# EAGLE design IQModulator (EAGLE 7.6.0)

## Sheet 1 of 3
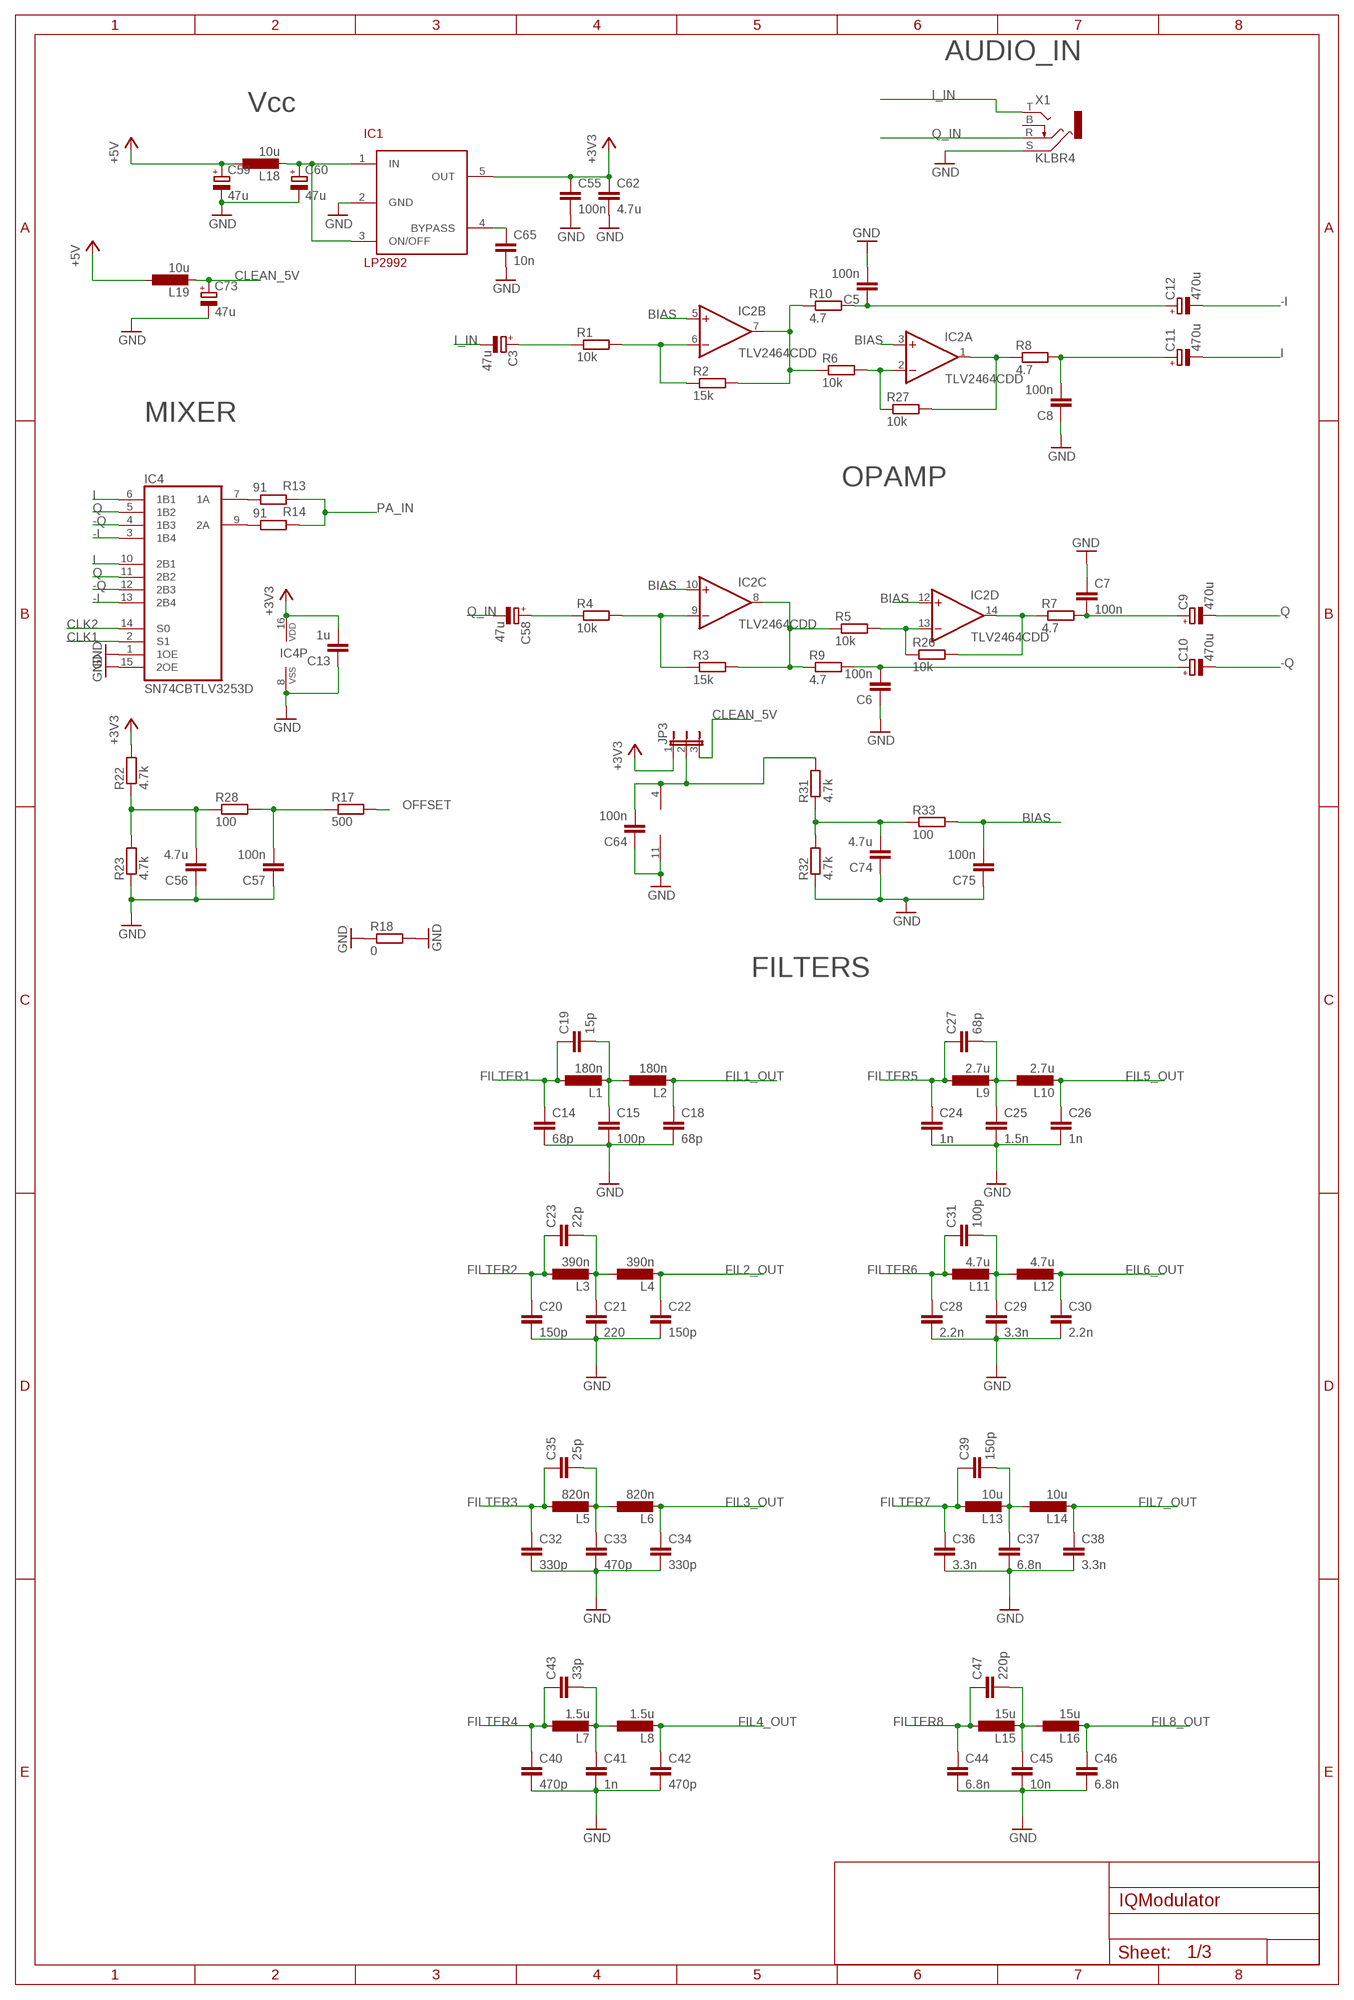
[diagram p0: schematic, sheet 1]

### Parts
C3  47u  CPOL-EUC  [PANASONIC_C]
C5  100n  C-EUC0805  [C0805]
C6  100n  C-EUC0805  [C0805]
C7  100n  C-EUC0805  [C0805]
C8  100n  C-EUC0805  [C0805]
C9  470u  CPOL-EUD  [PANASONIC_D]
C10  470u  CPOL-EUD  [PANASONIC_D]
C11  470u  CPOL-EUD  [PANASONIC_D]
C12  470u  CPOL-EUD  [PANASONIC_D]
C13  1u  C-EUC0805  [C0805]
C14  68p  C-EUC0805  [C0805]
C15  100p  C-EUC0805  [C0805]
C18  68p  C-EUC0805  [C0805]
C19  15p  C-EUC0805  [C0805]
C20  150p  C-EUC0805  [C0805]
C21  220  C-EUC0805  [C0805]
C22  150p  C-EUC0805  [C0805]
C23  22p  C-EUC0805  [C0805]
C24  1n  C-EUC0805  [C0805]
C25  1.5n  C-EUC0805  [C0805]
C26  1n  C-EUC0805  [C0805]
C27  68p  C-EUC0805  [C0805]
C28  2.2n  C-EUC0805  [C0805]
C29  3.3n  C-EUC0805  [C0805]
C30  2.2n  C-EUC0805  [C0805]
C31  100p  C-EUC0805  [C0805]
C32  330p  C-EUC0805  [C0805]
C33  470p  C-EUC0805  [C0805]
C34  330p  C-EUC0805  [C0805]
C35  25p  C-EUC0805  [C0805]
C36  3.3n  C-EUC0805  [C0805]
C37  6.8n  C-EUC0805  [C0805]
C38  3.3n  C-EUC0805  [C0805]
C39  150p  C-EUC0805  [C0805]
C40  470p  C-EUC0805  [C0805]
C41  1n  C-EUC0805  [C0805]
C42  470p  C-EUC0805  [C0805]
C43  33p  C-EUC0805  [C0805]
C44  6.8n  C-EUC0805  [C0805]
C45  10n  C-EUC0805  [C0805]
C46  6.8n  C-EUC0805  [C0805]
C47  220p  C-EUC0805  [C0805]
C55  100n  C-EUC0805  [C0805]
C56  4.7u  C-EUC0805  [C0805]
C57  100n  C-EUC0805  [C0805]
C58  47u  CPOL-EUC  [PANASONIC_C]
C59  47u  CPOL-EUC  [PANASONIC_C]
C60  47u  CPOL-EUC  [PANASONIC_C]
C62  4.7u  C-EUC0805  [C0805]
C64  100n  C-EUC0805  [C0805]
C65  10n  C-EUC0805  [C0805]
C73  47u  CPOL-EUC  [PANASONIC_C]
C74  4.7u  C-EUC0805  [C0805]
C75  100n  C-EUC0805  [C0805]
IC1  LP2992  [SOT-23-5]
IC2  TLV2464CDD  [SO14]
IC4  SN74CBTLV3253D  [SO16]
JP3  JP2E  [JP2]
L1  180n  LL0805  [L0805]
L2  180n  LL0805  [L0805]
L3  390n  LL0805  [L0805]
L4  390n  LL0805  [L0805]
L5  820n  LL0805  [L0805]
L6  820n  LL0805  [L0805]
L7  1.5u  LL0805  [L0805]
L8  1.5u  LL0805  [L0805]
L9  2.7u  LL0805  [L0805]
L10  2.7u  LL0805  [L0805]
L11  4.7u  LL0805  [L0805]
L12  4.7u  LL0805  [L0805]
L13  10u  LL0805  [L0805]
L14  10u  LL0805  [L0805]
L15  15u  L1008  [L1008]
L16  15u  L1008  [L1008]
L18  10u  L1008  [L1008]
L19  10u  L1008  [L1008]
R1  10k  R-EU_R0805  [R0805]
R2  15k  R-EU_R0805  [R0805]
R3  15k  R-EU_R0805  [R0805]
R4  10k  R-EU_R0805  [R0805]
R5  10k  R-EU_R0805  [R0805]
R6  10k  R-EU_R0805  [R0805]
R7  4.7  R-EU_R0805  [R0805]
R8  4.7  R-EU_R0805  [R0805]
R9  4.7  R-EU_R0805  [R0805]
R10  4.7  R-EU_R0805  [R0805]
R13  91  R-EU_R0805  [R0805]
R14  91  R-EU_R0805  [R0805]
R17  500  R-EU_R0805  [R0805]
R18  0  R-EU_R0805  [R0805]
R22  4.7k  R-EU_R0805  [R0805]
R23  4.7k  R-EU_R0805  [R0805]
R26  10k  R-EU_R0805  [R0805]
R27  10k  R-EU_R0805  [R0805]
R28  100  R-EU_R0805  [R0805]
R31  4.7k  R-EU_R0805  [R0805]
R32  4.7k  R-EU_R0805  [R0805]
R33  100  R-EU_R0805  [R0805]
X1  KLBR4  [KLBR4]

### Nets
+3V3: C13.2 C55.1 C62.1 IC1.5(OUT) IC4.16(VDD) JP3.1 R22.2 ; also sheet 2,3
+5V: C59.+ L18.P$1 L19.P$1 ; also sheet 2,3
-I: C12.- IC4.3(1B4) IC4.13(2B4)
-Q: C10.- IC4.4(1B3) IC4.12(2B3)
BIAS: C75.2 IC2.3(A:+IN) IC2.5(B:+IN) IC2.10(C:+IN) IC2.12(D:+IN) R33.2
CLEAN_5V: C73.+ JP3.3 L19.P$2
CLK1: IC4.2(S1) ; also sheet 2
CLK2: IC4.14(S0) ; also sheet 2
FIL1_OUT: C18.1 L2.P$2 ; also sheet 3
FIL2_OUT: C22.1 L4.P$2 ; also sheet 3
FIL3_OUT: C34.1 L6.P$2 ; also sheet 3
FIL4_OUT: C42.1 L8.P$2 ; also sheet 3
FIL5_OUT: C26.1 L10.P$2 ; also sheet 3
FIL6_OUT: C30.1 L12.P$2 ; also sheet 3
FIL7_OUT: C38.1 L14.P$2 ; also sheet 3
FIL8_OUT: C46.1 L16.P$2 ; also sheet 3
FILTER1: C14.1 C19.1 L1.P$1 ; also sheet 3
FILTER2: C20.1 C23.1 L3.P$1 ; also sheet 3
FILTER3: C32.1 C35.1 L5.P$1 ; also sheet 3
FILTER4: C40.1 C43.1 L7.P$1 ; also sheet 3
FILTER5: C24.1 C27.1 L9.P$1 ; also sheet 3
FILTER6: C28.1 C31.1 L11.P$1 ; also sheet 3
FILTER7: C36.1 C39.1 L13.P$1 ; also sheet 3
FILTER8: C44.1 C47.1 L15.P$1 ; also sheet 3
GND: C5.2 C6.1 C7.1 C8.1 C13.1 C14.2 C15.2 C18.2 C20.2 C21.2 C22.2 C24.2 C25.2 C26.2 C28.2 C29.2 C30.2 C32.2 C33.2 C34.2 C36.2 C37.2 C38.2 C40.2 C41.2 C42.2 C44.2 C45.2 C46.2 C55.2 C56.1 C57.1 C59.- C60.- C62.2 C64.1 C65.2 C73.- C74.1 C75.1 IC1.2(GND) IC2.11(P:V-) IC4.1(1OE) IC4.8(VSS) IC4.15(2OE) R18.1 R18.2 R23.1 R32.1 X1.S ; also sheet 2,3
I: C11.- IC4.6(1B1) IC4.10(2B1)
I_IN: C3.- X1.T
N$1: C57.2 R17.1 R28.2
N$2: C3.+ R1.1
N$3: IC2.6(B:-IN) R1.2 R2.1
N$4: C58.+ R4.1
N$5: IC2.9(C:-IN) R3.1 R4.2
N$6: IC2.8(C:OUT) R3.2 R5.1 R9.1
N$7: IC2.13(D:-IN) R5.2 R26.1
N$8: IC2.7(B:OUT) R2.2 R6.1 R10.1
N$9: IC2.2(A:-IN) R6.2 R27.1
N$10: IC2.1(A:OUT) R8.1 R27.2
N$11: IC2.14(D:OUT) R7.1 R26.2
N$12: C5.1 C12.+ R10.2
N$13: C6.2 C10.+ R9.2
N$14: C7.2 C9.+ R7.2
N$15: C8.2 C11.+ R8.2
N$16: IC4.7(1A) R13.2
N$17: IC4.9(2A) R14.2
N$18: C15.1 C19.2 L1.P$2 L2.P$1
N$20: C21.1 C23.2 L3.P$2 L4.P$1
N$27: C25.1 C27.2 L9.P$2 L10.P$1
N$29: C29.1 C31.2 L11.P$2 L12.P$1
N$31: C33.1 C35.2 L5.P$2 L6.P$1
N$33: C37.1 C39.2 L13.P$2 L14.P$1
N$35: C41.1 C43.2 L7.P$2 L8.P$1
N$36: C56.2 R22.1 R23.2 R28.1
N$37: C45.1 C47.2 L15.P$2 L16.P$1
N$42: C65.1 IC1.4(BYPASS)
N$51: C74.2 R31.1 R32.2 R33.1
N$54: C64.2 IC2.4(P:V+) JP3.2 R31.2
N$69: C60.+ IC1.1(IN) IC1.3(ON/OFF) L18.P$2
OFFSET: R17.2 ; also sheet 3
PA_IN: R13.1 R14.1 ; also sheet 3
Q: C9.- IC4.5(1B2) IC4.11(2B2)
Q_IN: C58.- X1.R
Unconnected: X1.B

### Notes on the sheet
- AUDIO_IN
- Vcc
- MIXER
- OPAMP
- FILTERS

## Sheet 2 of 3
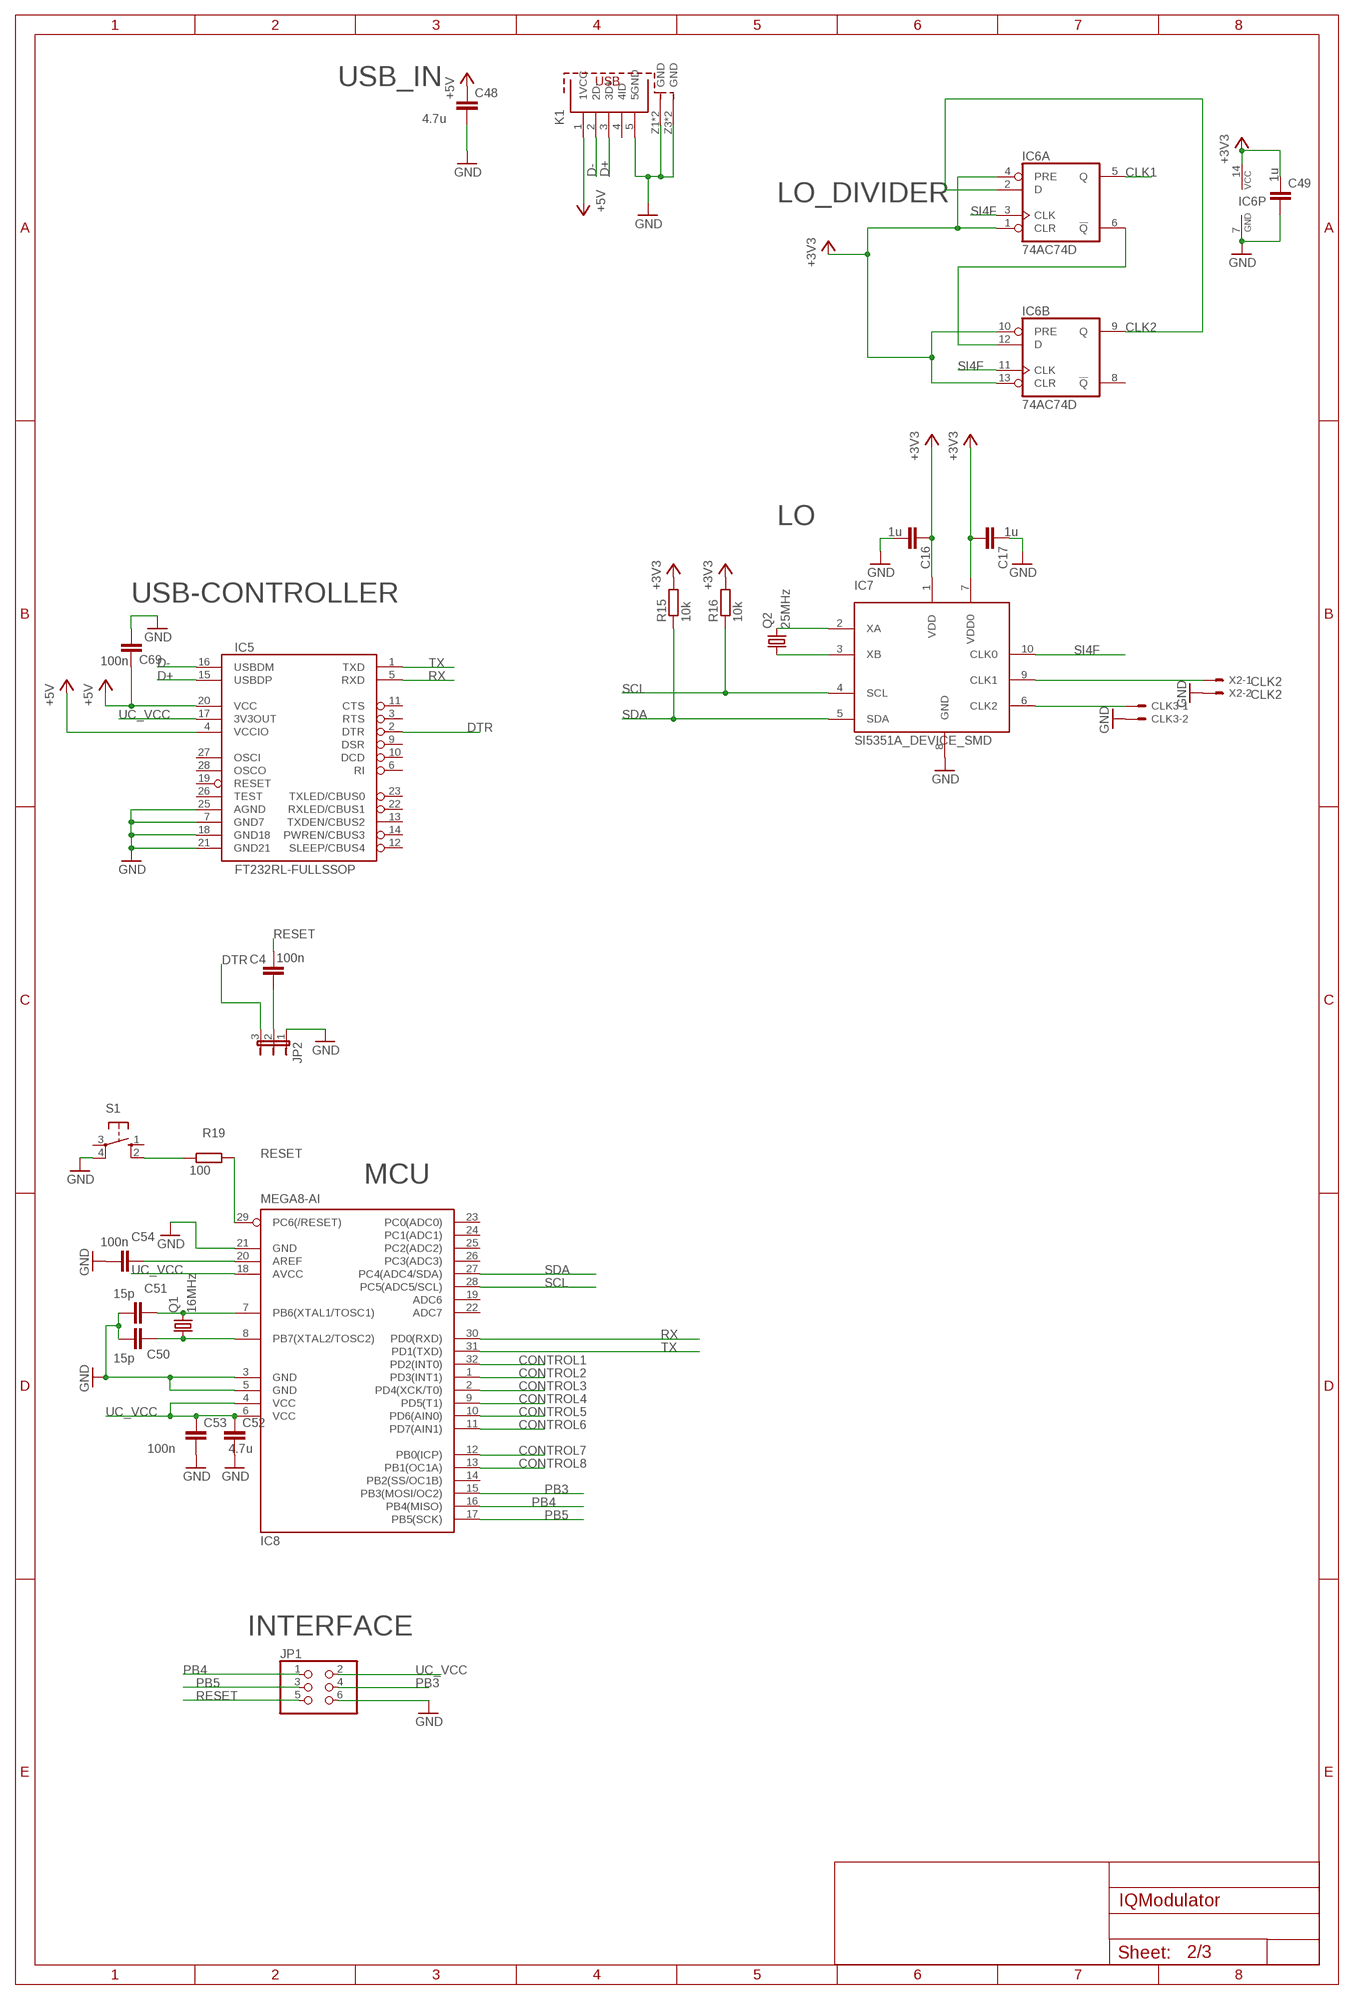
[diagram p1: schematic, sheet 2]

### Parts
C4  100n  C-EUC0805  [C0805]
C16  1u  C-EUC0805  [C0805]
C17  1u  C-EUC0805  [C0805]
C48  4.7u  C-EUC0805  [C0805]
C49  1u  C-EUC0805  [C0805]
C50  15p  C-EUC0805  [C0805]
C51  15p  C-EUC0805  [C0805]
C52  4.7u  C-EUC0805  [C0805]
C53  100n  C-EUC0805  [C0805]
C54  100n  C-EUC0805  [C0805]
C69  100n  C-EUC0805  [C0805]
CLK3  KK-156-2  [KK-156-2]
IC5  FT232RL-FULLSSOP  [SSOP28DB]
IC6  74AC74D  [SO14]
IC7  SI5351A_DEVICE_SMD  [10-MSOP]
IC8  MEGA8-AI  [TQFP32-08]
JP1  HEADER-2X3  [2X03_ROUND_70MIL]
JP2  JP2E  [JP2]
K1  629105150521  [629105150521]
Q1  16MHz  CRYSTALHC49S  [HC49/S]
Q2  25MHz  CRYSTALHC49S  [HC49/S]
R15  10k  R-EU_R0805  [R0805]
R16  10k  R-EU_R0805  [R0805]
R19  100  R-EU_R0805  [R0805]
S1  10-XX  [B3F-10XX]
X2  CLK2  KK-156-2  [KK-156-2]

### Nets
+3V3: C16.1 C17.2 C49.1 IC6.1(A:CLR) IC6.4(A:PRE) IC6.10(B:PRE) IC6.13(B:CLR) IC6.14(P:VCC) IC7.1(VDD) IC7.7(VDD0) R15.2 R16.2 ; also sheet 1,3
+5V: C48.1 C69.1 IC5.4(VCCIO) IC5.20(VCC) K1.1(1VCC) ; also sheet 1,3
CLK1: IC6.5(A:Q) ; also sheet 1
CLK2: IC6.2(A:D) IC6.9(B:Q) ; also sheet 1
CONTROL1: IC8.32(PD2(INT0)) ; also sheet 3
CONTROL2: IC8.1(PD3(INT1)) ; also sheet 3
CONTROL3: IC8.2(PD4(XCK/T0)) ; also sheet 3
CONTROL4: IC8.9(PD5(T1)) ; also sheet 3
CONTROL5: IC8.10(PD6(AIN0)) ; also sheet 3
CONTROL6: IC8.11(PD7(AIN1)) ; also sheet 3
CONTROL7: IC8.12(PB0(ICP)) ; also sheet 3
CONTROL8: IC8.13(PB1(OC1A)) ; also sheet 3
D+: IC5.15(USBDP) K1.3(3D+)
D-: IC5.16(USBDM) K1.2(2D-)
DTR: IC5.2(DTR) JP2.3
GND: C16.2 C17.1 C48.2 C49.2 C50.2 C51.2 C52.2 C53.2 C54.2 C69.2 CLK3.2 IC5.7(GND7) IC5.18(GND18) IC5.21(GND21) IC5.25(AGND) IC6.7(P:GND) IC7.8(GND) IC8.3(GND) IC8.5(GND) IC8.21(GND) JP1.6 JP2.1 K1.5(5GND) K1.Z1(GND) K1.Z2(GND) K1.Z3(GND) K1.Z4(GND) S1.4(P1) X2.2 ; also sheet 1,3
N$19: C51.1 IC8.7(PB6(XTAL1/TOSC1)) Q1.2
N$21: IC6.6(A:!Q) IC6.12(B:D)
N$22: IC7.3(XB) Q2.1
N$23: IC7.2(XA) Q2.2
N$25: C4.2 JP2.2
N$26: R19.1 S1.2(S1)
N$28: C50.1 IC8.8(PB7(XTAL2/TOSC2)) Q1.1
N$32: C54.1 IC8.20(AREF)
N$34: IC7.9(CLK1) X2.1
N$41: CLK3.1 IC7.6(CLK2)
PB3: IC8.15(PB3(MOSI/OC2)) JP1.4
PB4: IC8.16(PB4(MISO)) JP1.1
PB5: IC8.17(PB5(SCK)) JP1.3
RESET: C4.1 IC8.29(PC6(/RESET)) JP1.5 R19.2
RX: IC5.5(RXD) IC8.30(PD0(RXD))
SCL: IC7.4(SCL) IC8.28(PC5(ADC5/SCL)) R16.1
SDA: IC7.5(SDA) IC8.27(PC4(ADC4/SDA)) R15.1
SI4F: IC6.3(A:CLK) IC6.11(B:CLK) IC7.10(CLK0)
TX: IC5.1(TXD) IC8.31(PD1(TXD))
UC_VCC: C52.1 C53.1 IC5.17(3V3OUT) IC8.4(VCC) IC8.6(VCC) IC8.18(AVCC) JP1.2
Unconnected: IC5.3(RTS) IC5.6(RI) IC5.9(DSR) IC5.10(DCD) IC5.11(CTS) IC5.12(SLEEP/CBUS4) IC5.13(TXDEN/CBUS2) IC5.14(PWREN/CBUS3) IC5.19(RESET) IC5.22(RXLED/CBUS1) IC5.23(TXLED/CBUS0) IC5.26(TEST) IC5.27(OSCI) IC5.28(OSCO) IC6.8(B:!Q) IC8.14(PB2(SS/OC1B)) IC8.19(ADC6) IC8.22(ADC7) IC8.23(PC0(ADC0)) IC8.24(PC1(ADC1)) IC8.25(PC2(ADC2)) IC8.26(PC3(ADC3)) K1.4(4ID) S1.1(S) S1.3(P)

### Notes on the sheet
- USB_IN
- LO_DIVIDER
- LO
- USB-CONTROLLER
- MCU
- INTERFACE

## Sheet 3 of 3
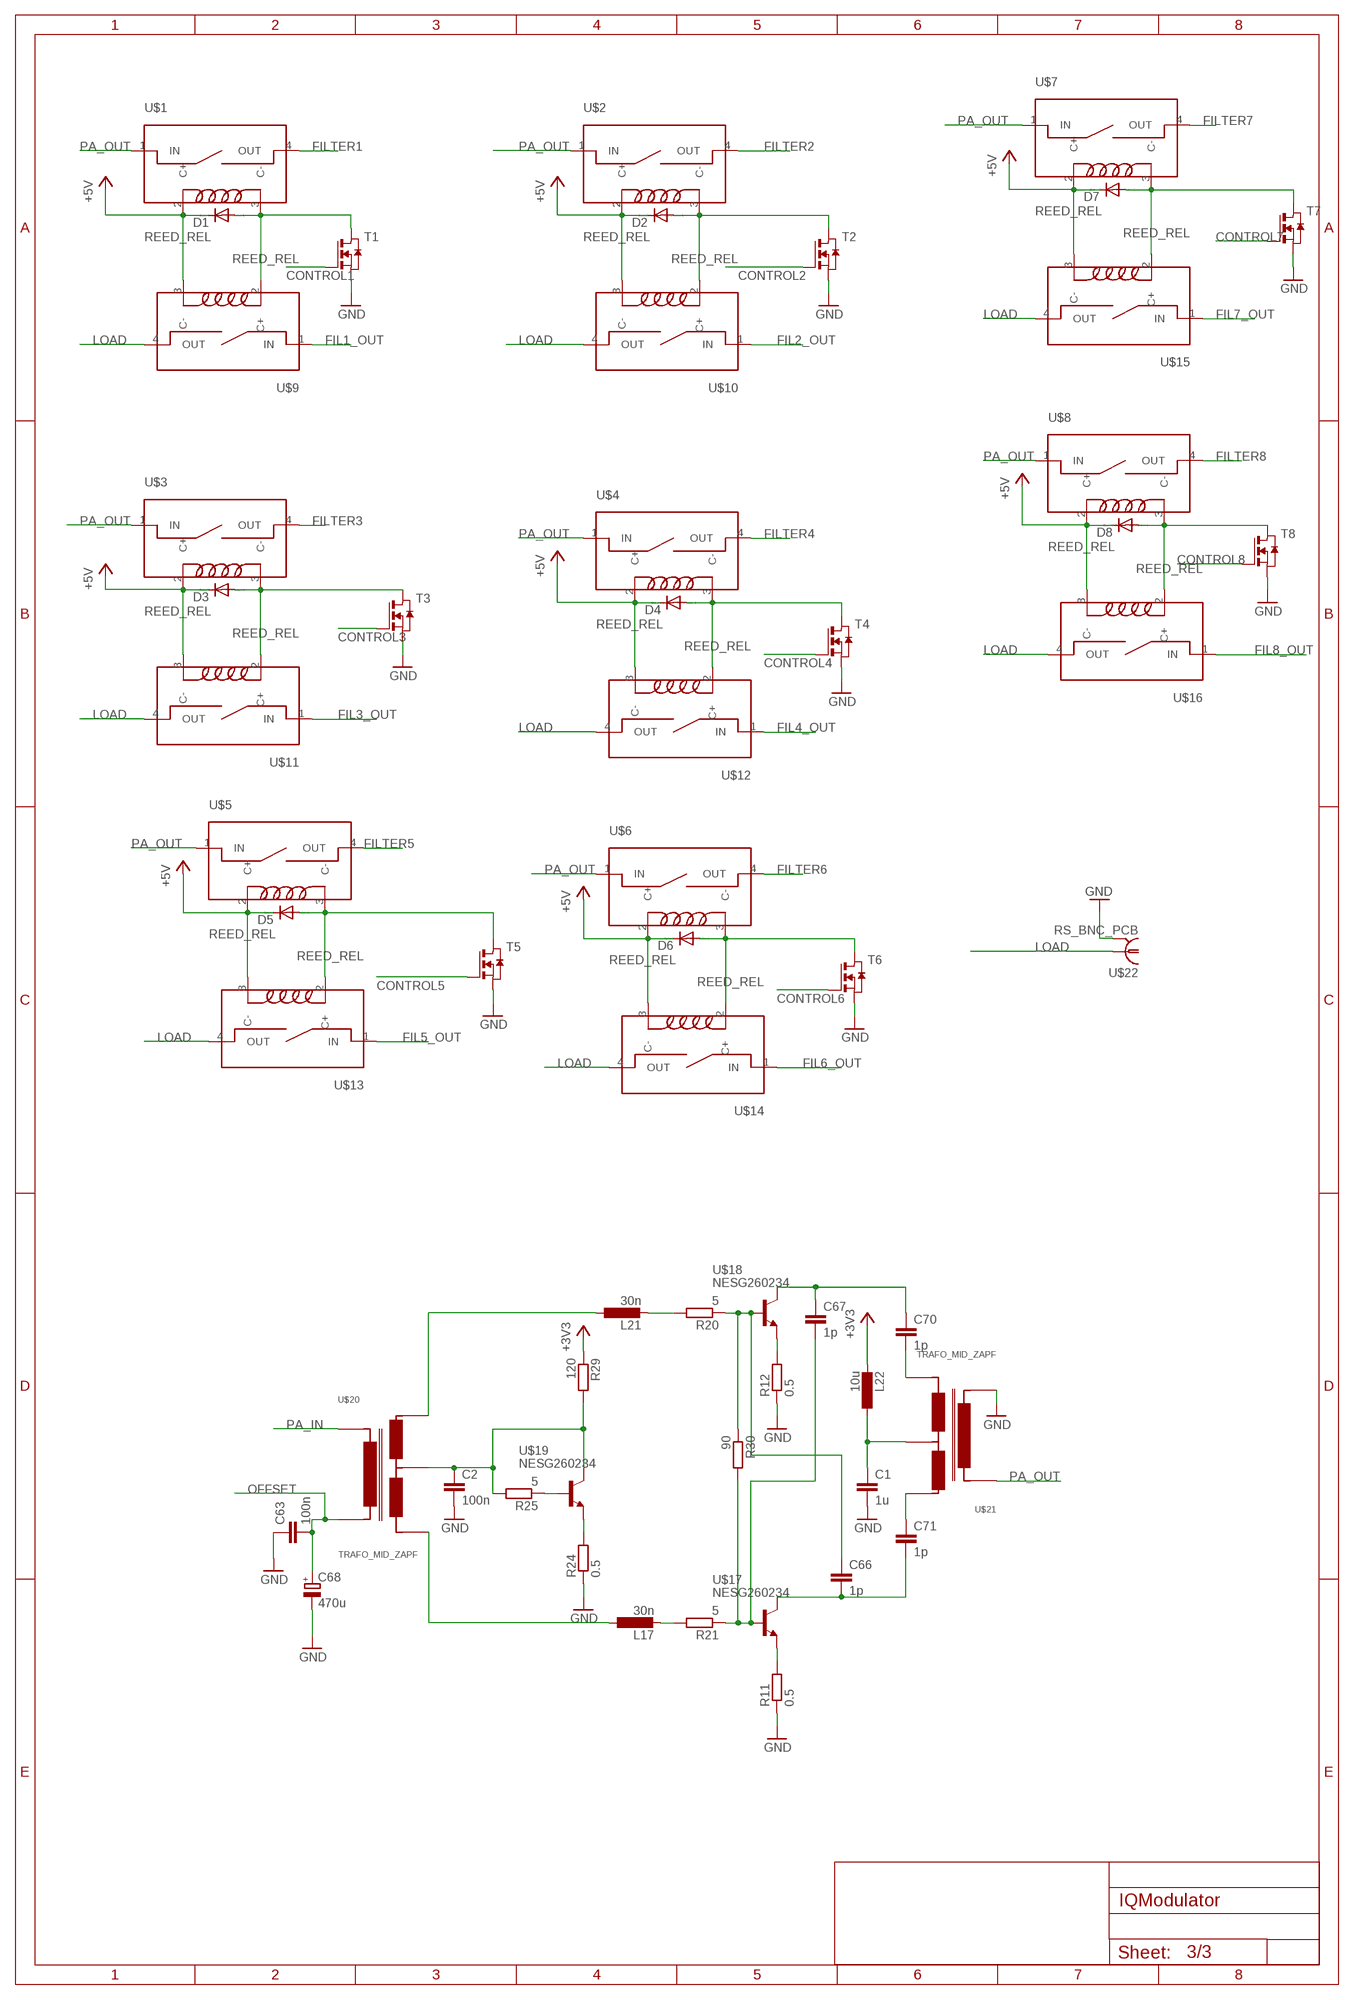
[diagram p2: schematic, sheet 3]

### Parts
C1  1u  C-EUC0805  [C0805]
C2  100n  C-EUC0805  [C0805]
C63  100n  C-EUC0805  [C0805]
C66  1p  C-EUC0805  [C0805]
C67  1p  C-EUC0805  [C0805]
C68  470u  CPOL-EUD  [PANASONIC_D]
C70  1p  C-EUC0805  [C0805]
C71  1p  C-EUC0805  [C0805]
D1  DIODE-DO214AA  [DO214AA]
D2  DIODE-DO214AA  [DO214AA]
D3  DIODE-DO214AA  [DO214AA]
D4  DIODE-DO214AA  [DO214AA]
D5  DIODE-DO214AA  [DO214AA]
D6  DIODE-DO214AA  [DO214AA]
D7  DIODE-DO214AA  [DO214AA]
D8  DIODE-DO214AA  [DO214AA]
L17  30n  LL0805  [L0805]
L21  30n  LL0805  [L0805]
L22  10u  LL0805  [L0805]
R11  0.5  R-EU_R0805  [R0805]
R12  0.5  R-EU_R0805  [R0805]
R20  5  R-EU_R0805  [R0805]
R21  5  R-EU_R0805  [R0805]
R24  0.5  R-EU_R0805  [R0805]
R25  5  R-EU_R0805  [R0805]
R29  120  R-EU_R0805  [R0805]
R30  90  R-EU_R0805  [R0805]
T1  NMOSSOT23  [SOT-23]
T2  NMOSSOT23  [SOT-23]
T3  NMOSSOT23  [SOT-23]
T4  NMOSSOT23  [SOT-23]
T5  NMOSSOT23  [SOT-23]
T6  NMOSSOT23  [SOT-23]
T7  NMOSSOT23  [SOT-23]
T8  NMOSSOT23  [SOT-23]
U$1  REED_REL  [REED_RELAY]
U$2  REED_REL  [REED_RELAY]
U$3  REED_REL  [REED_RELAY]
U$4  REED_REL  [REED_RELAY]
U$5  REED_REL  [REED_RELAY]
U$6  REED_REL  [REED_RELAY]
U$7  REED_REL  [REED_RELAY]
U$8  REED_REL  [REED_RELAY]
U$9  REED_REL  [REED_RELAY]
U$10  REED_REL  [REED_RELAY]
U$11  REED_REL  [REED_RELAY]
U$12  REED_REL  [REED_RELAY]
U$13  REED_REL  [REED_RELAY]
U$14  REED_REL  [REED_RELAY]
U$15  REED_REL  [REED_RELAY]
U$16  REED_REL  [REED_RELAY]
U$17  NESG260234  [SOT-89]
U$18  NESG260234  [SOT-89]
U$19  NESG260234  [SOT-89]
U$20  TRAFO_MID_ZAPF  [TRAFO_MID_ZAPF]
U$21  TRAFO_MID_ZAPF  [TRAFO_MID_ZAPF]
U$22  RS_BNC_PCB  [COAX-RS]

### Nets
+3V3: L22.P$2 R29.1 ; also sheet 1,2
+5V: D1.C D2.C D3.C D4.C D5.C D6.C D7.C D8.C U$1.2(C+) U$2.2(C+) U$3.2(C+) U$4.2(C+) U$5.2(C+) U$6.2(C+) U$7.2(C+) U$8.2(C+) U$9.3(C-) U$10.3(C-) U$11.3(C-) U$12.3(C-) U$13.3(C-) U$14.3(C-) U$15.3(C-) U$16.3(C-) ; also sheet 1,2
CONTROL1: T1.3(G) ; also sheet 2
CONTROL2: T2.3(G) ; also sheet 2
CONTROL3: T3.3(G) ; also sheet 2
CONTROL4: T4.3(G) ; also sheet 2
CONTROL5: T5.3(G) ; also sheet 2
CONTROL6: T6.3(G) ; also sheet 2
CONTROL7: T7.3(G) ; also sheet 2
CONTROL8: T8.3(G) ; also sheet 2
FIL1_OUT: U$9.1(IN) ; also sheet 1
FIL2_OUT: U$10.1(IN) ; also sheet 1
FIL3_OUT: U$11.1(IN) ; also sheet 1
FIL4_OUT: U$12.1(IN) ; also sheet 1
FIL5_OUT: U$13.1(IN) ; also sheet 1
FIL6_OUT: U$14.1(IN) ; also sheet 1
FIL7_OUT: U$15.1(IN) ; also sheet 1
FIL8_OUT: U$16.1(IN) ; also sheet 1
FILTER1: U$1.4(OUT) ; also sheet 1
FILTER2: U$2.4(OUT) ; also sheet 1
FILTER3: U$3.4(OUT) ; also sheet 1
FILTER4: U$4.4(OUT) ; also sheet 1
FILTER5: U$5.4(OUT) ; also sheet 1
FILTER6: U$6.4(OUT) ; also sheet 1
FILTER7: U$7.4(OUT) ; also sheet 1
FILTER8: U$8.4(OUT) ; also sheet 1
GND: C1.2 C2.2 C63.1 C68.- R11.1 R12.1 R24.1 T1.2(S) T2.2(S) T3.2(S) T4.2(S) T5.2(S) T6.2(S) T7.2(S) T8.2(S) U$21.PRIMARY_BOTTOM(PRIM_BOTTOM) U$22.P$1 U$22.P$2 U$22.P$3 U$22.P$4 ; also sheet 1,2
LOAD: U$9.4(OUT) U$10.4(OUT) U$11.4(OUT) U$12.4(OUT) U$13.4(OUT) U$14.4(OUT) U$15.4(OUT) U$16.4(OUT) U$22.MID
N$30: D6.A T6.1(D) U$6.3(C-) U$14.2(C+)
N$38: D1.A T1.1(D) U$1.3(C-) U$9.2(C+)
N$39: D5.A T5.1(D) U$5.3(C-) U$13.2(C+)
N$40: D7.A T7.1(D) U$7.3(C-) U$15.2(C+)
N$43: D4.A T4.1(D) U$4.3(C-) U$12.2(C+)
N$44: R11.2 U$17.C(E)
N$45: D3.A T3.1(D) U$3.3(C-) U$11.2(C+)
N$46: D8.A T8.1(D) U$8.3(C-) U$16.2(C+)
N$47: D2.A T2.1(D) U$2.3(C-) U$10.2(C+)
N$48: C71.1 U$21.SECONDARY1(SEC_TOP)
N$49: C70.2 U$21.SECONDARY2(SEC_BOT)
N$56: R12.2 U$18.C(E)
N$57: C66.2 C71.2 U$17.E(C)
N$58: C67.1 C70.1 U$18.E(C)
N$59: C67.2 R21.1 R30.2 U$17.B
N$60: C66.1 R20.1 R30.1 U$18.B
N$61: R24.2 U$19.C(E)
N$62: R25.1 U$19.B
N$63: C2.1 R25.2 R29.2 U$19.E(C) U$20.SECONDARY_MID(SEC_MID)
N$64: L21.P$2 R20.2
N$65: L17.P$2 R21.2
N$66: L21.P$1 U$20.SECONDARY1(SEC_TOP)
N$67: L17.P$1 U$20.SECONDARY2(SEC_BOT)
N$68: C1.1 L22.P$1 U$21.SECONDARY_MID(SEC_MID)
OFFSET: C63.2 C68.+ U$20.PRIMARY_BOTTOM(PRIM_BOTTOM) ; also sheet 1
PA_IN: U$20.PRIMARY_TOP(PRIM_TOP) ; also sheet 1
PA_OUT: U$1.1(IN) U$2.1(IN) U$3.1(IN) U$4.1(IN) U$5.1(IN) U$6.1(IN) U$7.1(IN) U$8.1(IN) U$21.PRIMARY_TOP(PRIM_TOP)

## Library data of the parts
C1 C2 C63 C66 C67 C70 C71 = _Bachelor-IQModulator:C-EU: CAPACITOR, European symbol
C3 C9-C12 C58-C60 C68 C73 = resistor:CPOL-EU: POLARIZED CAPACITOR, European symbol
C4-C8 C13-C57 C62 C64 C65 C69 C74 C75 = resistor:C-EU: CAPACITOR, European symbol
CLK3 X2 = con-molex:KK-156-2: KK 156 HEADER Source: http://www.molex.com/pdm_docs/sd/026604100_sd.pdf; OC_FARNELL: unknown; OC_NEWARK: unknown
D1-D8 = diode:DIODE-: DIODE
IC1 = _Bachelor-IQModulator:LP2992
IC2 = _Bachelor-IQModulator:TLV2464CD: OP AMP
IC4 = _Bachelor-IQModulator:SN74CBTLV3253: Dual 4-channel DATA SELECTOR/MULTIPLEXER
IC5 = microbuilder:FT232RL-FULL: USB UART FT232RL 4 - Complete Pinout Footprint courtesy Spark Fun Electronics
IC6 = 74xx-eu:74*74: Dual D type positive edge triggered FLIP FLOP, preset and clear
IC7 = Mischer:SI5351A_DEVICE: Si5351A Clock Generator SELF MADE!
IC8 = atmel:MEGA8: MICROCONTROLLER 8 Kbytes FLASH, 1 kbytes SRAM, 512 bytes EEPROM, USART, 6-channel 10 bit ADC, 2-channel 8 bit ADC Pin compatible with Atmega48, ATMega88, ATMega168 Source: avr.lbr; MPN: ATMEGA8-16AU; OC_FARNELL: 9171371; OC_NEWARK: 73M8863
JP1 = microbuilder:HEADER-2X3: PIN HEADER
JP2 JP3 = jumper:JP2E: JUMPER
K1 = Input-Output_Connectors_rev15d:629105150521: WR-COM_USB_Micro Type B_Horizontal_SMT ; Micro Type B Horizontal SMT - 3A current at Pin1 & Pin 5 - with Pegs and THT shielding Pins - T&R Packaging Code : Con_I-O_COM_USB_2.0_B_629105150521_629105150521 <http://katalog.we-online.de/media/images/eican/Con_I-O_COM_USB_2.0_B_629105150521_pf2.jpg> Details see: http://katalog.we-online.de/em/datasheet/629105150521.pdf Created 12/08/2014, Dan Xu 2014 (C) Wurth Elektronik
L1-L14 L17 L21 L22 = _Bachelor-IQModulator:L
L15 L16 L18 L19 = _Bachelor_IQ_Mischer:L1008
Q1 Q2 = crystal:CRYSTAL: CRYSTAL; OC_FARNELL: 1667008; OC_NEWARK: unknown
R1-R10 R13-R19 R22 R23 R26-R28 R31-R33 = resistor:R-EU_: RESISTOR, European symbol
R11 R12 R20 R21 R24 R25 R29 R30 = _Bachelor-IQModulator:R-EU_: RESISTOR, European symbol
S1 = switch-omron:10-XX: OMRON SWITCH; MPN: B3F-1000; OC_FARNELL: 176432; OC_NEWARK: 36M3542
T1-T8 = zetex:NMOSSOT23: MOS FET; OC_FARNELL: unknown; OC_NEWARK: unknown
U$1-U$16 = _Bachelor-IQModulator:REED_REL
U$17-U$19 = _Bachelor-IQModulator:NESG260234
U$20 U$21 = _Bachelor-IQModulator:TRAFO_MID_ZAPF
U$22 = _Bachelor-IQModulator:RS_BNC_PCB
X1 = con-lumberg:KLBR4: Jack connectors according to JISC 6560, 3.5 mm Klinkeneinbaukupplung nach JISC 6560, 3,5 mm, 3-polig/ stereo, abgewinkelte Ausführung, mit Öffner, für Leiterplatten Source: Data sheet <http://www.lumberg.com/Produkte/PDFs/KLBR4.pdf>; MPN: KLBR 4; OC_FARNELL: 1217016; OC_NEWARK: 97K2709

## Board
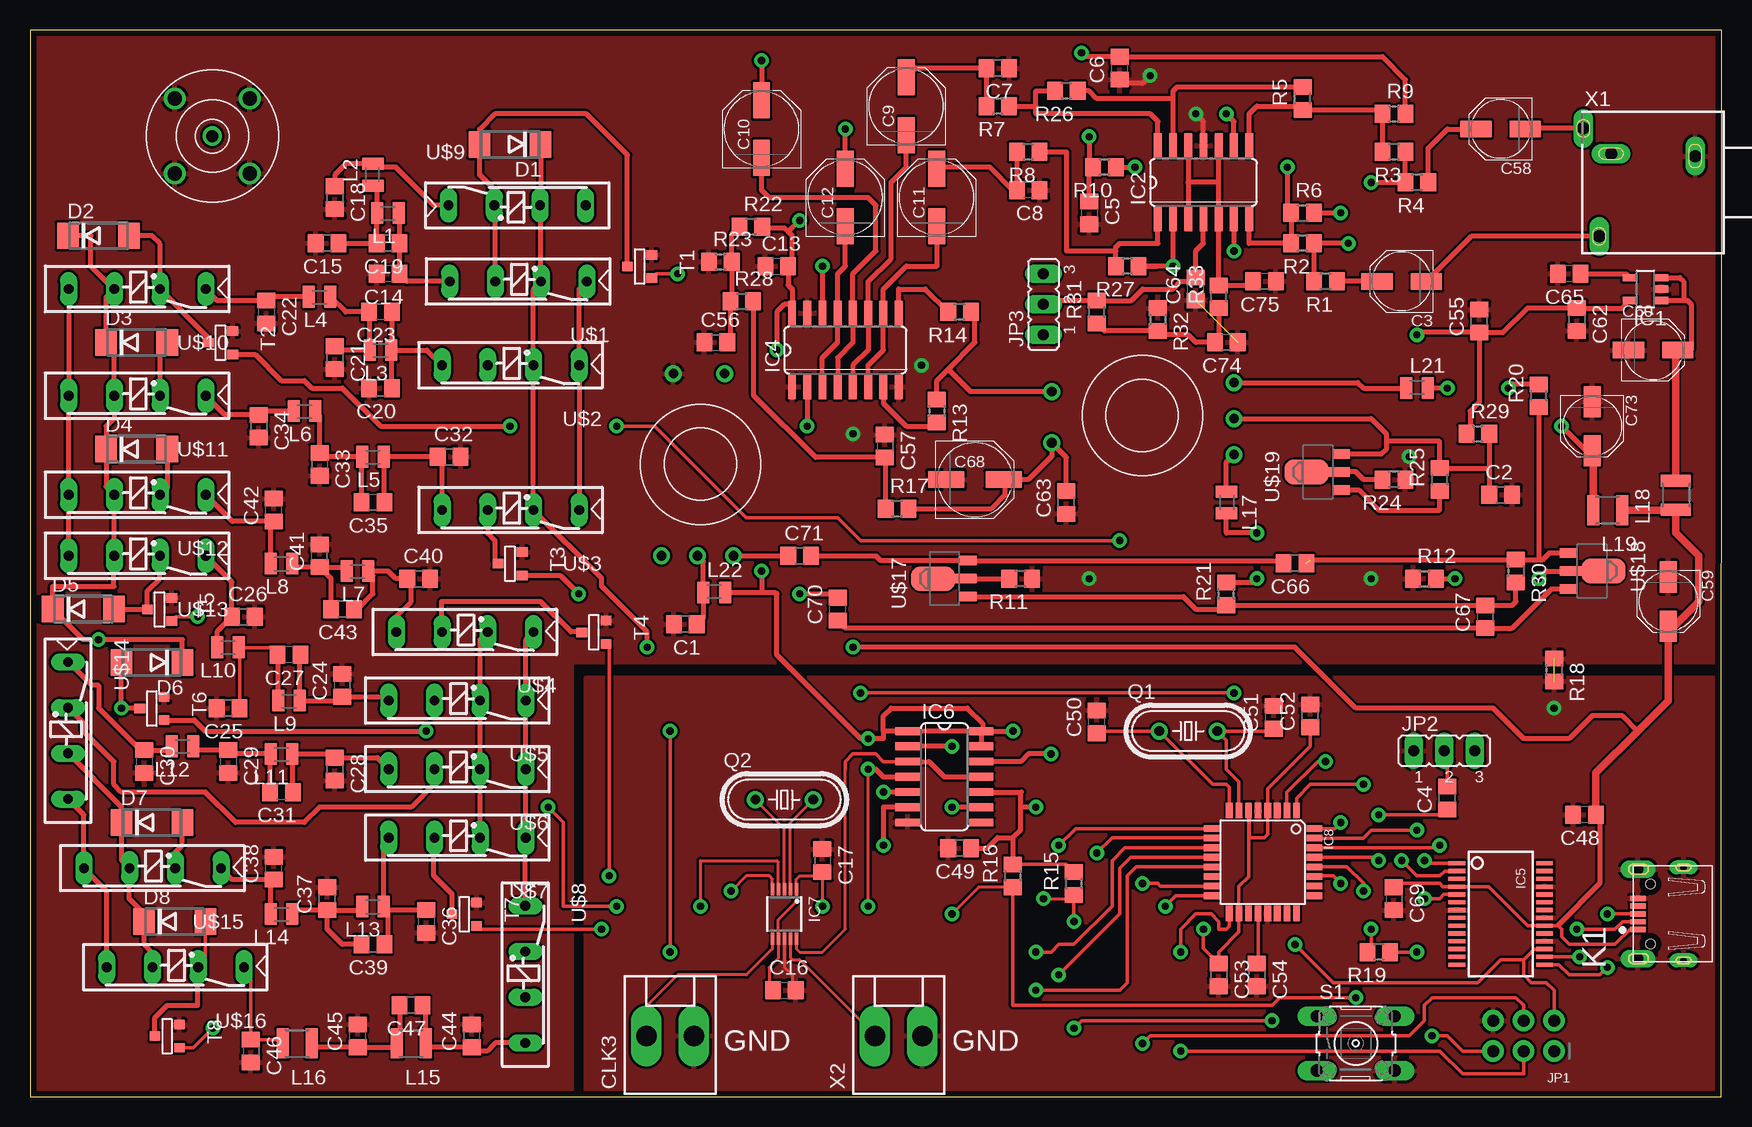
[diagram p3: board, top side]
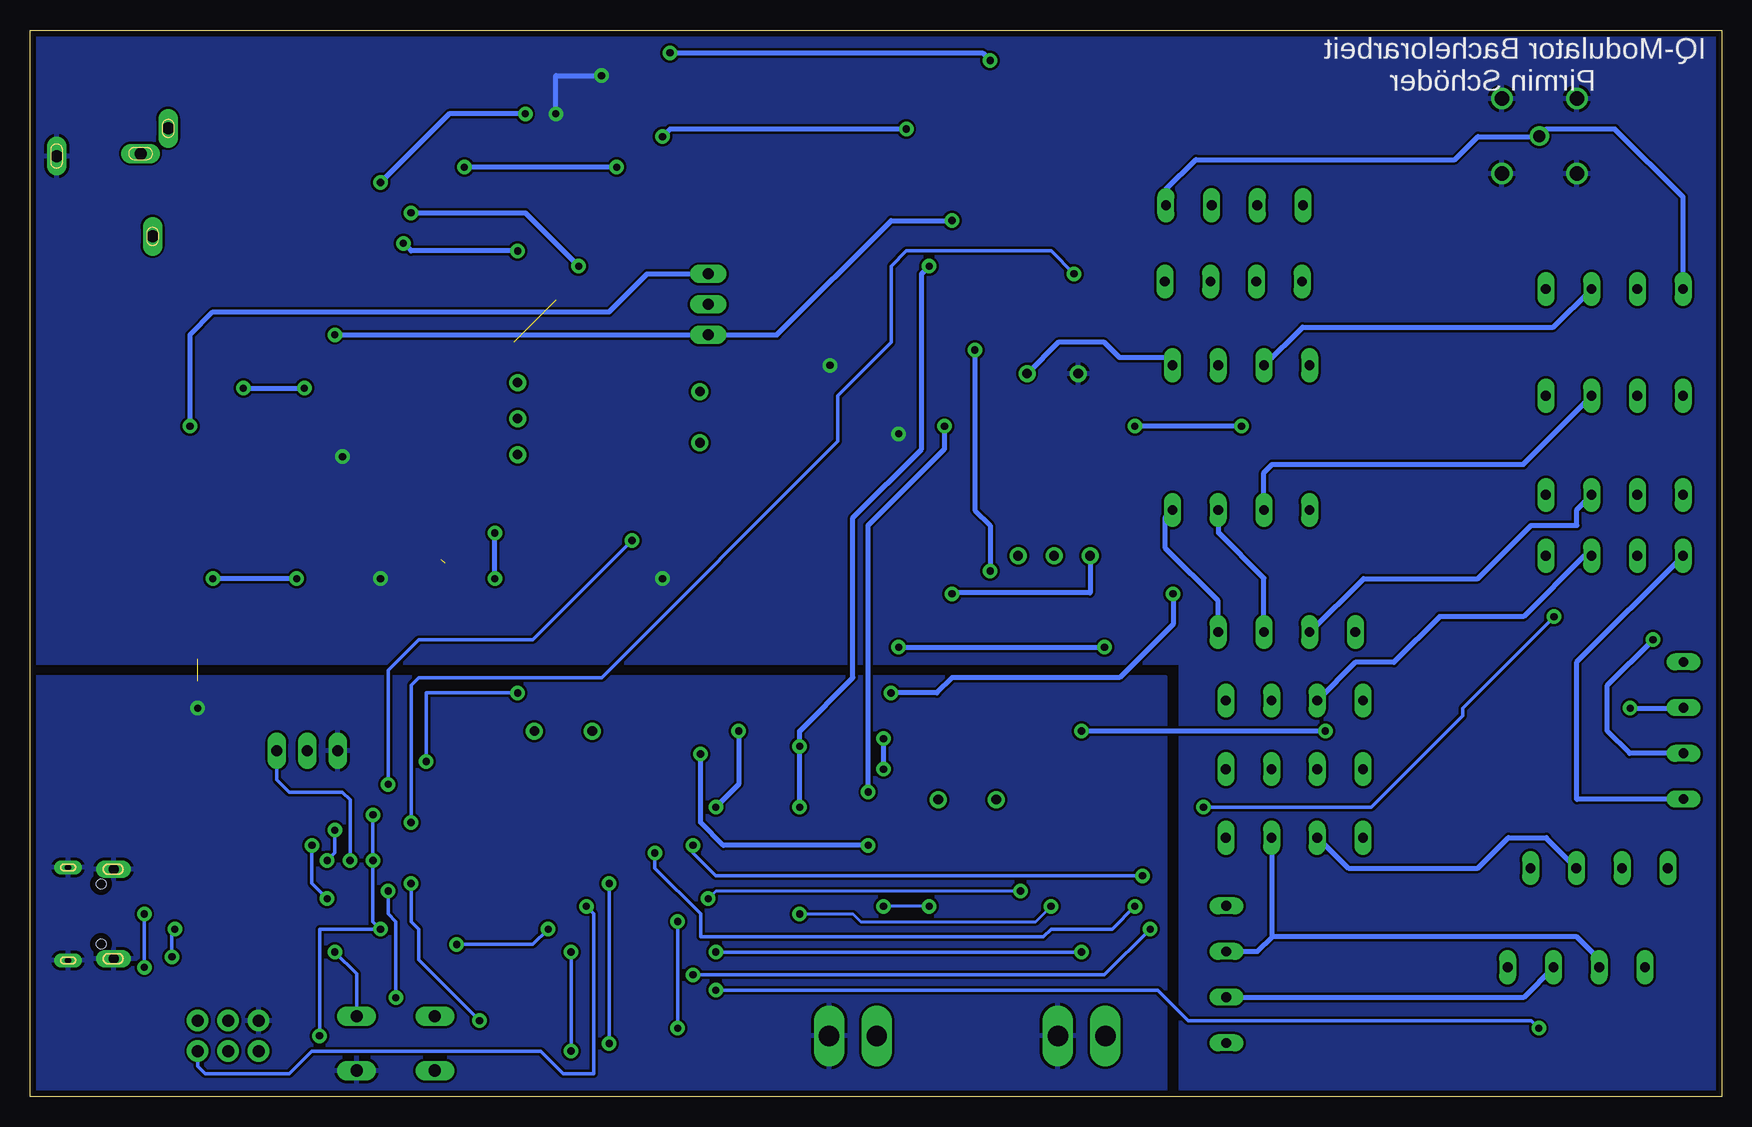
[diagram p4: board, bottom side, seen from below]

Size 140.97 x 88.9 mm. Coordinates in mm from the lower left corner, seen from the top.
Outline: 0,0 140.95,0 140.97,88.9 0,88.9 0,0
Copper layers (1*16): Top 0.035mm / dielectric 1.5mm / Bottom 0.035mm
Design rules "Standard12_lpt *": minimum track width 7mil, minimum drill 16mil, track to track 8mil, track to pad 8mil, pad to pad 8mil, via to via 8mil, smd to smd 0mil, copper to edge 20mil, drill to drill 8mil, minimum pad ring 12mil, minimum via ring 12mil, stop-mask expansion 4mil, vias tented up to drill 0mil, thermal gap 10mil

### Footprints (pad centres in the part's own frame; a part is rotated, then mirrored left to right if it is on the bottom)
C0805 = smd 1.3 x 1.5: 1 -0.95,0; 2 0.95,0
PANASONIC_C = smd 2.6 x 1.4: + 2.05,0; - -2.05,0
PANASONIC_D = smd 3 x 1.4: + 2.4,0; - -2.4,0
KK-156-2 = drill 1.7 pad 2.184 long: 1 -1.98,0; 2 1.98,0
DO214AA = smd 1.8 x 2.2: A 2.55,0; C -2.55,0
SOT-23-5 = smd 0.6 x 1.2: 1 -0.95,-1.306; 2 0,-1.306; 3 0.95,-1.306; 4 0.95,1.306; 5 -0.95,1.306
SO14 = smd 0.66 x 2.032: 1 -3.81,-3.073; 2 -2.54,-3.073; 3 -1.27,-3.073; 4 0,-3.073; 5 1.27,-3.073; 6 2.54,-3.073; 7 3.81,-3.073; 8 3.81,3.073; 9 2.54,3.073; 10 1.27,3.073; 11 0,3.073; 12 -1.27,3.073; 13 -2.54,3.073; 14 -3.81,3.073
SO16 = smd 0.66 x 2.032: 1 -4.445,-3.073; 2 -3.175,-3.073; 3 -1.905,-3.073; 4 -0.635,-3.073; 5 0.635,-3.073; 6 1.905,-3.073; 7 3.175,-3.073; 8 4.445,-3.073; 9 4.445,3.073; 10 3.175,3.073; 11 1.905,3.073; 12 0.635,3.073; 13 -0.635,3.073; 14 -1.905,3.073; 15 -3.175,3.073; 16 -4.445,3.073
SSOP28DB = smd 0.348 x 1.397: 1 -4.225,-3.656; 2 -3.575,-3.656; 3 -2.925,-3.656; 4 -2.275,-3.656; 5 -1.625,-3.656; 6 -0.975,-3.656; 7 -0.325,-3.656; 8 0.325,-3.656; 9 0.975,-3.656; 10 1.625,-3.656; 11 2.275,-3.656; 12 2.925,-3.656; 13 3.575,-3.656; 14 4.225,-3.656; 15 4.225,3.656; 16 3.575,3.656; 17 2.925,3.656; 18 2.275,3.656; 19 1.625,3.656; 20 0.975,3.656; 21 0.325,3.656; 22 -0.325,3.656; 23 -0.975,3.656; 24 -1.625,3.656; 25 -2.275,3.656; 26 -2.925,3.656; 27 -3.575,3.656; 28 -4.225,3.656
10-MSOP = smd 0.3 x 1: 1 -1,-2.05; 2 -0.5,-2.05; 3 0,-2.05; 4 0.5,-2.05; 5 1,-2.05; 6 1,2.05; 7 0.5,2.05; 8 0,2.05; 9 -0.5,2.05; 10 -1,2.05
TQFP32-08 = smd 1.27 x 0.559: 1 -4.293,2.8; 2 -4.293,2; 3 -4.293,1.2; 4 -4.293,0.4; 5 -4.293,-0.4; 6 -4.293,-1.2; 7 -4.293,-2; 8 -4.293,-2.8; 17 4.293,-2.8; 18 4.293,-2; 19 4.293,-1.2; 20 4.293,-0.4; 21 4.293,0.4; 22 4.293,1.2; 23 4.293,2; 24 4.293,2.8 | smd 0.559 x 1.27: 9 -2.8,-4.293; 10 -2,-4.293; 11 -1.2,-4.293; 12 -0.4,-4.293; 13 0.4,-4.293; 14 1.2,-4.293; 15 2,-4.293; 16 2.8,-4.293; 25 2.8,4.293; 26 2,4.293; 27 1.2,4.293; 28 0.4,4.293; 29 -0.4,4.293; 30 -1.2,4.293; 31 -2,4.293; 32 -2.8,4.293
2X03_ROUND_70MIL = drill 1 pad 1.778: 1 -2.54,1.27; 2 -2.54,-1.27; 3 0,1.27; 4 0,-1.27; 5 2.54,1.27; 6 2.54,-1.27
JP2 = drill 0.914 long: 1 -2.54,0; 2 0,0; 3 2.54,0
629105150521 = smd 0.45 x 1.3: 1 -1.3,3.8; 2 -0.65,3.8; 3 0,3.8; 4 0.65,3.8; 5 1.3,3.8 | drill 0.85 pad 1.2 long: Z1 -3.725,3.8; Z2 3.725,3.8 | drill 0.55 pad 0.9 long: Z3 3.875,0; Z4 -3.875,0 | hole 0.8: -2.5,2.75; 2.5,2.75
L0805 = smd 1 x 1.8: P$1 -0.9,0; P$2 0.9,0
L1008 = smd 1 x 2.5: P$1 -1.24,0; P$2 1.173,0
HC49/S = drill 0.813: 1 -2.413,0; 2 2.413,0
R0805 = smd 1.3 x 1.5: 1 -0.95,0; 2 0.95,0
B3F-10XX = drill 1.016 long: 1 -3.251,2.261; 2 3.251,2.261; 3 -3.251,-2.261; 4 3.251,-2.261
SOT-23 = smd 0.787 x 0.889: 1 0.025,-1.016; 2 -0.94,1.016; 3 0.991,1.016
REED_RELAY = drill 0.813 long: 1 -13.38,1.905; 2 -9.57,1.905; 3 -5.76,1.905; 4 -1.95,1.905
SOT-89 = smd 0.8 x 1.4: B -1.499,-1.981; E 1.499,-1.981 | smd 0.8 x 1.9: C 0,-1.727 | smd 2.032 x 3.65: C@1 0,0.94
TRAFO_MID_ZAPF = drill 0.8: PRIMARY_BOTTOM -13.914,-2.008; PRIMARY_TOP -13.914,2.254; SECONDARY1 1.27,3; SECONDARY2 1.27,-3; SECONDARY_MID 1.27,0
COAX-RS = drill 1: MID -3.125,3.125 | drill 1.2: P$1 0,0; P$2 -6.25,0; P$3 0,6.25; P$4 -6.25,6.25
KLBR4 = drill 1 pad 1.3 long: B -2.4,-3.5; S -2.2,3.5 | drill 1 pad 1.2 long: R -4.5,-5.8; T 4.5,-4.5

### Placement (x,y rotation side)
C1  54.61,39.37 180 top
C2  122.56,50.16 0 top
C3  114.3,67.94 180 top
C4  118.11,24.89 90 top
C5  88.27,73.66 270 top
C6  90.81,85.72 90 top
C7  80.64,85.72 180 top
C8  83.19,75.56 180 top
C9  73.03,82.55 90 top
C10  60.96,80.64 90 top
C11  75.56,74.93 90 top
C12  67.94,74.93 90 top
C13  62.23,69.22 0 top
C14  29.84,68.58 180 top
C15  24.77,71.12 180 top
C16  62.87,8.89 0 top
C17  66.04,19.68 270 top
C18  25.4,74.93 270 top
C19  29.84,71.12 180 top
C20  29.21,59.05 180 top
C21  25.4,61.59 270 top
C22  19.68,65.41 270 top
C23  29.21,65.41 180 top
C24  26.04,34.29 90 top
C25  16.51,32.38 180 top
C26  17.78,40.01 0 top
C27  21.59,36.83 180 top
C28  25.4,27.3 270 top
C29  16.51,27.94 270 top
C30  9.53,27.94 270 top
C31  20.95,25.4 180 top
C32  34.92,53.34 0 top
C33  24.13,52.7 270 top
C34  19.05,55.88 270 top
C35  28.57,49.53 180 top
C36  33.02,14.61 270 top
C37  24.77,16.51 90 top
C38  20.32,19.05 90 top
C39  28.57,12.7 180 top
C40  32.38,43.18 0 top
C41  24.13,45.09 90 top
C42  20.32,48.9 90 top
C43  26.04,40.64 180 top
C44  36.83,5.08 90 top
C45  27.3,5.08 90 top
C46  18.41,3.81 270 top
C47  31.75,7.62 180 top
C48  129.54,23.5 180 top
C49  77.47,20.7 180 top
C50  88.9,31.24 90 top
C51  103.63,31.62 90 top
C52  106.68,31.75 90 top
C53  99.06,10.16 270 top
C54  102.23,10.16 270 top
C55  120.78,64.64 90 top
C56  57.15,62.87 0 top
C57  71.25,54.23 270 top
C58  122.56,80.64 180 top
C59  136.53,41.27 270 top
C60  135.25,62.23 0 top
C62  128.91,64.77 270 top
C63  86.36,49.53 90 top
C64  97.16,67.31 90 top
C65  128.27,68.58 180 top
C66  105.41,44.45 180 top
C67  121.28,40.01 90 top
C68  78.74,51.44 0 top
C69  113.67,16.51 270 top
C70  67.31,40.64 90 top
C71  64.14,45.09 0 top
C73  130.18,55.88 270 top
C74  99.69,62.87 180 top
C75  102.87,67.94 180 top
CLK3  53.34,5.08 0 top
D1  40.01,79.38 180 top
D2  5.71,71.75 0 top
D3  8.89,62.87 0 top
D4  8.89,53.98 0 top
D5  4.45,40.64 0 top
D6  10.16,36.2 180 top
D7  10.16,22.86 0 top
D8  12.06,14.61 0 top
IC1  134.62,67.31 90 top
IC2  97.79,76.2 0 top
IC4  67.94,62.23 0 top
IC5  122.56,15.24 270 top
IC6  76.2,26.67 270 top
IC7  62.87,15.24 180 top
IC8  102.74,19.56 270 top
JP1  124.46,5.08 180 top
JP2  117.86,28.83 0 top
JP3  84.45,66.04 90 top
K1  137.79,15.24 90 top
L1  29.84,73.66 180 top
L2  28.57,76.83 90 top
L3  29.21,62.23 180 top
L4  24.13,66.67 180 top
L5  28.57,53.34 180 top
L6  22.86,57.15 180 top
L7  27.3,43.81 180 top
L8  20.95,44.45 180 top
L9  21.59,33.02 180 top
L10  16.51,37.47 180 top
L11  20.95,28.57 180 top
L12  12.7,29.21 180 top
L13  28.57,15.88 180 top
L14  20.95,15.24 180 top
L15  31.75,4.45 180 top
L16  22.23,4.45 180 top
L17  99.69,49.53 270 top
L18  137.16,50.16 90 top
L19  131.44,48.9 180 top
L21  115.57,59.05 0 top
L22  57.02,42.04 0 top
Q1  96.52,30.48 0 top
Q2  62.87,24.77 0 top
R1  107.95,67.94 180 top
R2  106.05,71.12 180 top
R3  113.67,78.74 180 top
R4  115.57,76.2 180 top
R5  106.05,83.19 90 top
R6  106.05,73.66 0 top
R7  80.64,82.55 180 top
R8  83.19,78.74 180 top
R9  113.67,81.92 0 top
R10  89.53,77.47 180 top
R11  82.55,43.18 180 top
R12  116.2,43.18 0 top
R13  75.56,57.15 270 top
R14  77.47,65.41 180 top
R15  87,17.78 90 top
R16  81.92,18.41 90 top
R17  72.26,49.02 0 top
R18  127,35.56 270 top
R19  112.39,12.06 180 top
R20  125.73,58.42 90 top
R21  99.69,41.91 90 top
R22  60.07,72.52 0 top
R23  57.53,69.6 0 top
R24  113.67,51.44 180 top
R25  117.47,51.44 90 top
R26  86.36,83.82 180 top
R27  91.44,69.22 180 top
R28  59.31,66.29 0 top
R29  120.65,55.24 0 top
R30  123.83,43.81 270 top
R31  88.9,65.41 90 top
R32  93.98,64.77 270 top
R33  99.06,66.67 90 top
S1  110.49,4.45 0 top
T1  50.8,69.22 270 top
T2  15.88,62.87 270 top
T3  40.01,44.45 270 top
T4  46.99,38.73 270 top
T5  10.79,40.64 270 top
T6  10.16,32.38 270 top
T7  36.2,15.24 270 top
T8  11.43,5.08 270 top
U$1  33.02,69.85 180 top
U$2  32.38,62.87 180 top
U$3  32.38,50.8 180 top
U$4  28.57,40.64 180 top
U$5  27.94,34.92 180 top
U$6  27.94,29.21 180 top
U$7  27.94,23.5 180 top
U$8  39.37,2.54 270 top
U$9  48.26,72.39 0 top
U$10  1.27,69.22 180 top
U$11  1.27,60.33 180 top
U$12  1.27,52.07 180 top
U$13  1.27,46.99 180 top
U$14  1.27,22.86 270 top
U$15  2.54,20.95 180 top
U$16  4.45,12.7 180 top
U$17  76.2,43.18 90 top
U$18  130.18,43.81 270 top
U$19  107.31,52.07 90 top
U$20  99.06,56.52 0 top
U$21  55.63,46.35 270 top
U$22  12.06,83.19 180 top
X1  135.25,76.2 270 top
X2  72.39,5.08 0 top

### Tracks (layer width: path | path; a pad name or v marks a point on that pad's centre or on a via)
+3V3  (via drill 0.6)
  Top 0.254: C16.1 61.59,9.21 61.59,10.79 62.37,11.56 IC7.7 62.37,14.74 63.87,16.24 IC7.1 63.87,18.14 64.14,18.41 65.72,18.41 C17.2 v66.04,15.88 | v69.85,15.88 v69.85,27.3
  Top 0.305: R16.2 86.36,19.36 R15.2
  Top 0.406: IC6.10 82.62,25.4 82.55,25.33 82.55,24.13 | 82.55,24.13 82.55,22.23 81.92,21.59 | 79.38,30.48 v81.92,30.48 | v83.82,24.13 82.55,24.13 | IC6.14 IC6.13 | IC6.14 IC6.1 71.12,30.48 | 79.38,30.48 79.38,31.11 78.11,32.38 71.75,32.38 71.12,31.75 71.12,30.48 | 79.38,30.48 IC6.14 | 71.12,30.48 71.12,29.84 v69.85,29.84 69.22,29.84 62.23,36.83 62.23,41.91 62.1,42.04 60.96,42.04 | v69.85,27.3 70.48,27.3 71.12,26.67 IC6.4 | 81.92,21.59 R16.2 | C49.1 79.76,20.7 80.64,21.59 81.92,21.59 | IC1.5 132.67,65.72 C62.1 124.78,65.72 122.75,63.69 C55.1 | 115.89,63.82 v115.57,63.5 115.76,63.69 C55.1 | 63.18,72.07 63.5,71.75 63.5,69.53 C13.2 63.18,67.63 63.5,67.31 63.5,66.04 | 63.18,72.07 62.87,72.39 61.15,72.39 R22.2 | L22.P$2 60.96,42.04 | 63.5,66.04 IC4.16 | C55.1 120.78,57.91 120.02,57.15 120.02,55.56 R29.1 | 63.5,66.04 62.87,66.04 62.23,65.41 v62.23,62.23 | v60.96,43.81 60.96,42.04 | v64.14,73.03 63.18,72.07
  Bottom 0.254: v66.04,15.88 v69.85,15.88
  Bottom 0.406: v81.92,30.48 81.92,26.04 v83.82,24.13 | v69.85,29.84 v69.85,27.3 | v115.57,63.5 JP3.1 78.74,63.5 69.22,73.03 v64.14,73.03 | v62.23,62.23 62.23,48.9 60.96,47.62 v60.96,43.81
+5V  (via drill 0.6)
  Top 0.305: 127.34,14.27 IC5.20 124.8,14.27 121.55,17.52 IC5.4 117.74,17.52 117.47,17.78 113.98,17.78 C69.1 113.72,17.52 | 127.34,14.27 127.64,13.97 127.64,13.34 128.27,12.7 132.08,12.7 133.35,13.97 133.97,13.97 K1.1 | 127.34,14.27 127.34,14.31 | 130.81,23.18 C48.1
  Top 0.406: 130.81,23.18 130.81,17.78 127.34,14.31 | U$16.3 10.21,12.02 9.53,12.7 9.53,14.6 D8.C 9.52,15.25 8.26,16.51 8.26,19 U$15.3 7.61,19.74 D7.C 7.61,24.18 U$14.3 | D2.C 5.08,71.75 5.08,69.22 6.99,67.31 U$10.3 6.34,66.62 D3.C 7.03,62.17 U$11.3 7.03,56.56 6.35,55.88 D4.C 6.34,50.85 U$12.3 U$13.3 6.99,45.04 6.99,42.55 1.91,42.55 1.9,42.53 D5.C 4.43,38.1 v5.71,38.1 12.7,38.1 D6.C | D1.C 42.55,74.35 U$9.3 42.5,68.03 U$1.2 41.95,67.31 U$2.2 U$3.2 47.62,43.23 47.62,42.55 51.44,38.73 v51.44,37.47 | U$4.2 37.51,38.1 U$5.2 U$6.2 U$7.2 | 133.99,30.48 132.72,31.75 130.18,31.75 128.27,29.84 124.46,29.84 121.92,32.38 110.49,32.38 105.41,37.47 v68.58,37.47
  Top 0.61: C48.1 130.49,26.98 133.99,30.48 136.53,33.02 C59.+ 137.01,39.23 139.06,41.27 139.06,45.09 137.16,46.99 L18.P$1 137.13,48.9 L19.P$1
  Bottom 0.406: U$4.2 38.15,43.23 41.91,46.99 41.91,48.85 U$3.2 | U$8.2 38.69,12.11 37.47,13.34 | 37.47,13.34 37.47,21.55 U$7.2 | U$14.3 7.67,28.62 9.53,30.48 9.53,34.29 v5.71,38.1 | v68.58,37.47 v51.44,37.47 | U$16.3 10.21,11.47 12.06,13.34 37.47,13.34
-I
  Top 0.406: IC4.3 66.04,61.59 67.31,62.87 IC4.13 67.31,68.58 67.94,69.22 C12.-
-Q
  Top 0.406: IC4.4 67.31,61.59 68.58,62.87 IC4.12 68.58,68.58 70.48,70.48 70.48,74.3 69.85,74.93 61.59,74.93 60.96,75.56 C10.-
BIAS
  Top 0.406: IC2.12 96.52,76.2 | 96.52,76.2 IC2.3 | 99.06,76.2 IC2.5 R33.2 101.6,67.62 C75.2 | 99.06,76.2 IC2.10 | 99.06,76.2 96.52,76.2
CLEAN_5V  (via drill 0.6)
  Top 0.406: C73.+ 129.69,53.83 v127.64,55.88
  Top 0.61: L19.P$2 130.27,53.73 C73.+
  Bottom 0.406: v127.64,55.88 127.64,63.5 125.73,65.41 92.71,65.41 89.53,68.58 JP3.3
CLK1  (via drill 0.6)
  Top 0.406: IC6.5 v71.12,25.4 | IC4.2 v64.77,55.88
  Bottom 0.406: v71.12,25.4 71.12,47.62 64.77,53.98 v64.77,55.88
CLK2  (via drill 0.6)
  Top 0.406: IC6.9 v76.83,24.13 | v76.83,29.21 IC6.2 | v66.04,69.22 IC4.14
  Bottom 0.406: v76.83,24.13 v76.83,29.21 76.83,30.48 72.39,34.92 72.39,48.26 66.67,53.98 66.67,68.58 v66.04,69.22
CONTROL1  (via drill 0.6)
  Top 0.305: IC8.32 108.72,22.36 v109.22,22.86 | v53.98,68.58 52.17,68.58 T1.3
  Bottom 0.305: v109.22,22.86 109.22,34.29 108.58,34.92 93.34,34.92 73.66,54.61 73.66,58.42 69.22,62.87 69.22,69.22 67.94,70.48 55.88,70.48 v53.98,68.58
CONTROL2  (via drill 0.6)
  Top 0.305: IC8.1 105.54,24.9 106.68,26.04 v111.12,26.04 | v90.81,46.35 69.22,46.35 67.31,48.26 59.69,48.26 52.07,55.88 v48.9,55.88
  Top 0.406: T2.3 18.77,61.87 20.95,59.69 22.86,59.69 23.5,59.05 26.04,59.05 29.21,55.88 v40.01,55.88
  Bottom 0.305: v111.12,26.04 111.12,35.56 108.58,38.1 99.06,38.1 v90.81,46.35
  Bottom 0.406: v40.01,55.88 v48.9,55.88
CONTROL3  (via drill 0.6)
  Top 0.305: IC8.2 104.74,25.37 107.31,27.94 v107.95,27.94 | v69.22,33.66 v100.33,33.66
  Top 0.406: T3.3 44.17,43.46 v45.72,41.91
  Bottom 0.305: v107.95,27.94 107.95,33.66 v100.33,33.66
  Bottom 0.406: v45.72,41.91 45.72,39.37 50.16,34.92 64.14,34.92 65.41,33.66 v69.22,33.66
CONTROL4  (via drill 0.6)
  Top 0.305: IC8.9 87.13,22.36 v85.72,20.95 | v48.26,18.41 48.26,37.49 T4.3
  Bottom 0.305: v85.72,20.95 85.72,20.32 83.82,18.41 v48.26,18.41
CONTROL5  (via drill 0.6)
  Top 0.305: v88.9,20.32 90.17,21.59 98.42,21.59 IC8.10 | v13.97,40.01 12.17,40.01 T5.3 | v48.9,15.88 44.45,15.88 44.45,22.86 v43.18,24.13
  Bottom 0.305: v88.9,20.32 88.9,19.05 85.09,15.24 85.09,13.34 56.52,13.34 55.88,13.97 50.8,13.97 v48.9,15.88 | v43.18,24.13 29.21,24.13 21.59,31.75 21.59,32.38 v13.97,40.01
CONTROL6  (via drill 0.6)
  Top 0.305: IC8.11 91.24,20.76 90.17,19.68 90.17,15.88 87,12.7 85.72,12.7 85.09,12.06 v83.82,12.06 | v53.34,12.06 v53.34,30.48
  Top 0.406: T6.3 13.69,31.39 14.61,30.48 v33.02,30.48
  Bottom 0.305: v83.82,12.06 v53.34,12.06
  Bottom 0.406: v33.02,30.48 v53.34,30.48
CONTROL7  (via drill 0.6)
  Top 0.305: IC8.12 91.71,19.96 90.81,19.05 90.81,15.24 v85.72,10.16 | v47.62,13.97 37.49,13.97 T7.3
  Bottom 0.305: v85.72,10.16 51.44,10.16 v47.62,13.97
CONTROL8  (via drill 0.6)
  Top 0.305: IC8.13 92.18,19.16 91.44,18.41 91.44,9.53 90.81,8.89 v83.82,8.89 | T8.3 13.61,4.09 v15.24,5.71
  Bottom 0.305: v83.82,8.89 46.99,8.89 44.45,6.35 15.88,6.35 v15.24,5.71
D+  (via drill 0.6)
  Top 0.305: v131.44,15.24 K1.3 | IC5.15 127.42,11.02 128.27,10.16 130.81,10.16 v131.44,10.79
  Bottom 0.305: v131.44,10.79 v131.44,15.24
D-  (via drill 0.6)
  Top 0.305: IC5.16 v129.14,11.66 | v128.91,13.97 132.08,13.97 132.72,14.61 133.98,14.61 K1.2
  Bottom 0.305: v129.14,11.66 129.14,13.73 v128.91,13.97
DTR  (via drill 0.6)
  Top 0.305: IC5.2 117.88,18.82 117.47,18.41 115.57,18.41 v114.3,19.68
  Bottom 0.305: JP2.3 120.4,26.42 119.38,25.4 114.94,25.4 114.3,24.77 v114.3,19.68
FIL1_OUT
  Top 0.406: C18.1 25.4,76.83 26.3,77.73 L2.P$2 28.84,77.47 30.48,77.47 33.66,74.3 U$9.1
FIL2_OUT
  Top 0.406: L4.P$2 20,66.67 C22.1 15.61,66.36 U$10.1
FIL3_OUT
  Top 0.406: L6.P$2 19.37,57.15 C34.1 16.24,56.83 U$11.1
FIL4_OUT
  Top 0.406: L8.P$2 20.05,47.68 C42.1 16.87,47.95 U$12.1
FIL5_OUT
  Top 0.406: L10.P$2 15.61,38.78 C26.1 16.83,42.91 U$13.1
FIL6_OUT
  Top 0.406: U$14.1 5.12,34.29 5.71,34.29 5.71,32.38 8.89,29.21 9.21,29.21 C30.1 11.48,28.89 L12.P$2
FIL7_OUT
  Top 0.406: L14.P$2 20.05,17.84 C38.1 16.87,18.1 U$15.1
FIL8_OUT
  Top 0.305: L16.P$2 20.74,4.76 C46.1 18.41,10.21 U$16.1
FILTER1
  Top 0.406: U$1.4 31.43,67.94 C14.1 C19.1 30.8,73.61 L1.P$1
FILTER2
  Top 0.406: C20.1 30.16,62.18 L3.P$1 | L3.P$1 33.06,62.23 U$2.4 | C23.1 30.16,62.28 L3.P$1
FILTER3
  Top 0.406: U$3.4 34.34,52.98 C32.1 L5.P$1 29.52,53.29 C35.1
FILTER4
  Top 0.406: C43.1 27.3,40.64 28.57,41.91 28.57,43.45 L7.P$1 29.84,43.81 30.48,43.18 C40.1 31.75,42.87 31.75,41.27 30.52,40.05 U$4.4
FILTER5
  Top 0.406: U$5.4 29.57,33.34 C24.1 25.71,33.02 L9.P$1 22.49,36.78 C27.1
FILTER6
  Top 0.406: C31.1 21.91,28.52 L11.P$1 25.08,28.57 C28.1 28.94,28.25 U$6.4
FILTER7
  Top 0.406: C36.1 29.8,15.55 | 29.8,15.55 L13.P$1 29.48,21.18 U$7.4 | 29.8,15.55 29.8,12.97 C39.1
FILTER8
  Top 0.406: U$8.4 38.78,4.49 38.1,3.81 37.15,3.81 C44.1 33.3,4.13 L15.P$1 32.99,7.33 C47.1
GND  (via drill 0.6)  (2 unrouted)
  Top 0.254: IC7.8 62.87,10.79 63.5,10.16 63.5,9.21 C16.2
  Top 0.406: IC2.11 97.79,81.28 v97.16,81.92 | v93.34,85.09 92.71,84.45 91.12,84.45 C6.1
  Bottom 0.406: v97.16,81.92 97.16,85.09 v93.34,85.09
  other vias: 127,32.38 88.27,43.18 111.76,43.18 114.94,53.34 74.3,60.96 68.58,55.24
  pour Top: 46.35,34.92 140.97,34.92 140.97,0 46.35,0
  pour Bottom: 46.35,34.92 140.97,34.92 140.97,0 46.35,0
  pour Top: 0,88.9 140.97,88.9 140.97,36.2 45.09,36.2 45.09,0 0,0
  pour Bottom: 0,88.9 140.97,88.9 140.97,36.2 45.09,36.2 45.09,0 0,0
I
  Top 0.406: C11.- 75.56,69.22 73.03,69.22 71.12,67.31 IC4.10 71.12,62.23 69.85,60.96 IC4.6
I_IN
  Top 0.406: X1.T 120.11,71.7 C3.-
LOAD
  Top 0.406: U$16.4 6.39,17.14 U$15.4 4.49,23.5 U$14.4 | U$13.4 U$12.4 U$11.4 U$10.4
  Bottom 0.406: U$10.4 3.22,74.97 8.89,80.64 14.61,80.64 U$22.MID 15.24,80.01 20.32,80.01 22.23,78.11 43.81,78.11 46.31,75.61 U$9.4 | U$14.4 12.02,24.81 12.06,24.77 12.06,36.24 U$13.4
N$1
  Top 0.406: R17.1 71.31,53.21 C57.2 65.47,53.28 60.33,58.42 60.33,66.23 R28.2
N$2
  Top 0.406: C3.+ R1.1
N$3  (via drill 0.6)
  Top 0.406: R1.2 R2.1 v109.86,71.12 | IC2.6 v100.33,70.48
  Bottom 0.406: v100.33,70.48 109.22,70.48 v109.86,71.12
N$4
  Top 0.406: R4.1 116.52,79.06 118.11,80.64 C58.+
N$5  (via drill 0.6)
  Top 0.406: R3.1 R4.2 v111.76,76.2 | IC2.9 100.33,81.28 v99.69,81.92
  Bottom 0.406: v99.69,81.92 106.05,81.92 v111.76,76.2
N$6
  Top 0.406: R3.2 R9.1 112.39,82.23 R5.1 105.73,82.55 102.23,82.55 101.6,81.92 IC2.8
N$7
  Top 0.406: IC2.13 95.25,83.19 | 95.25,83.19 95.25,83.82 95.56,84.14 R5.2 | 95.25,83.19 88.9,83.19 88.27,83.82 R26.1
N$8  (via drill 0.6)
  Top 0.406: IC2.7 101.6,71.12 R2.2 R6.1 104.78,73.98 v104.78,77.47 | R10.1 v92.08,77.47
  Bottom 0.406: v92.08,77.47 v104.78,77.47
N$9  (via drill 0.6)
  Top 0.406: 93.98,69.22 R27.1 v95.25,69.22 IC2.2 | R6.2 v109.22,73.66
  Bottom 0.406: v109.22,73.66 99.69,73.66 v95.25,69.22
N$10
  Top 0.406: R27.2 90.49,70.48 | 90.49,70.48 90.49,70.81 90.81,71.12 93.98,71.12 IC2.1 | R8.1 86.36,78.74 86.36,70.48 90.49,70.48
N$11
  Top 0.406: IC2.14 93.98,81.28 93.34,81.92 83.82,81.92 83.82,82.55 | R26.2 83.82,83.82 83.82,82.55 | R7.1 83.82,82.55
N$12  (via drill 0.6)
  Top 0.406: C12.+ v67.94,80.64 | v88.27,80.01 88.27,77.79 R10.2 88.27,77.15 C5.1
  Bottom 0.406: v67.94,80.64 87.63,80.64 v88.27,80.01
N$13  (via drill 0.6)
  Top 0.406: R9.2 114.61,84.78 112.72,86.67 C6.2 87.95,86.67 v87.63,87 | v60.96,86.36 C10.+
  Bottom 0.406: v87.63,87 61.59,87 v60.96,86.36
N$14
  Top 0.406: C9.+ 73.8,85.72 C7.2 R7.2
N$15
  Top 0.406: R8.2 C8.2 81.92,75.56 80.01,77.47 75.7,77.47 C11.+
N$16
  Top 0.406: IC4.7 71.12,57.78 73.03,55.88 75.25,55.88 R13.2
N$17
  Top 0.406: IC4.9 72.39,67.31 74.61,67.31 R14.2
N$18
  Top 0.406: L2.P$1 28.95,75.56 L1.P$2 28.89,73.61 C19.2 C15.1
N$19
  Top 0.305: IC8.7 100.74,26.26 99.69,27.3 99.69,29.72 Q1.2 103.44,30.48 C51.1
N$20
  Top 0.406: C21.1 25.71,62.23 L3.P$2 28.26,62.28 C23.2 26.3,65.41 L4.P$1
N$21  (via drill 0.6)
  Top 0.406: IC6.6 71.12,24.13 v71.12,20.95 | v85.09,28.57 83.19,28.57 82.55,27.94 IC6.12
  Bottom 0.406: v71.12,20.95 83.19,20.95 85.09,22.86 v85.09,28.57
N$22
  Top 0.254: IC7.3 62.87,22.35 Q2.1
N$23
  Top 0.254: IC7.2 63.37,22.85 Q2.2
N$25
  Top 0.305: C4.2 118.11,28.57 JP2.2
N$26  (via drill 0.6)
  Top 0.305: v115.57,12.06 R19.1
  Bottom 0.305: S1.2 113.74,10.24 v115.57,12.06
N$27
  Top 0.305: C25.1 17.46,37.41 | 17.46,37.41 L10.P$1 | 17.46,37.41 20.05,37.41 C27.2
  Top 0.406: C27.2 20.64,33.07 L9.P$2
N$28
  Top 0.305: IC8.8 99.94,25.79 99.69,26.04 98.55,26.04 Q1.1 89.09,30.48 C50.1
N$29
  Top 0.406: C31.2 20,28.52 L11.P$2 16.82,28.57 C29.1 13.92,28.89 L12.P$1
N$30  (via drill 0.6)
  Top 0.406: T6.1 7.64,32.36 v7.62,32.38 7.62,36.19 D6.A | U$6.3 33.7,26.08 31.75,24.13 24.13,24.13 22.86,22.86 17.14,22.86 14.61,25.4 7.62,25.4 6.99,26.04 6.99,27.94 4.45,30.48 4.45,31.16 U$14.2
  Bottom 0.406: v7.62,32.38 3.22,32.38 U$14.2
N$31
  Top 0.406: C35.2 27.62,53.29 L5.P$2 24.45,53.34 C33.1 24.13,56.78 L6.P$1
N$32
  Top 0.305: IC8.20 102.34,11.22 C54.1
N$33
  Top 0.406: C39.2 26.04,12.7 24.77,13.97 C37.1 | C37.1 27.36,15.56 L13.P$2 | C37.1 22.18,15.56 L14.P$1
N$34
  Top 0.254: X2.1 69.85,5.71 64.14,11.43 63.5,11.43 63.37,11.56 IC7.9
N$35
  Top 0.406: C43.2 25.09,43.18 C41.1 | C41.1 26.09,44.13 L7.P$2 | C41.1 22.17,44.13 L8.P$1
N$36
  Top 0.406: R22.1 58.48,71.88 R23.2 58.48,66.42 R28.1 58.36,63.12 C56.2
N$37
  Top 0.406: C47.2 30.8,4.67 L15.P$2 30.26,4.13 C45.1 23.78,4.13 L16.P$1
N$38
  Top 0.406: U$1.3 38.78,74.2 U$9.2 38.69,75.61 37.47,76.83 37.47,79.36 D1.A 37.47,80.64 38.73,81.92 46.35,81.92 49.78,78.49 T1.1
N$39
  Top 0.406: D5.A 9.75,40.64 T5.1 9.78,42.16 10.79,43.18 10.79,45.04 U$13.2
  Bottom 0.406: U$13.2 11.43,45.09 16.51,40.01 23.5,40.01 27.3,36.2 30.52,36.2 U$5.3
N$40
  Top 0.406: U$15.2 12.11,20.36 12.7,20.95 D7.A | T7.1 35.18,16.89 33.66,18.41 33.66,21.55 U$7.3
  Bottom 0.406: U$7.3 33.66,21.59 31.11,19.05 20.32,19.05 17.78,21.59 14.61,21.59 14.61,21.55 U$15.2
N$41
  Top 0.254: IC7.6 61.87,12.34 59.69,10.16 53.98,10.16 51.44,7.62 51.44,5.16 CLK3.1
N$42
  Top 0.406: C65.1 132.99,68.58 IC1.4
N$43
  Top 0.406: D4.A 11.44,50.77 U$12.2 | T4.1 45.74,38.71 45.72,38.73 45.09,38.73 42.55,41.27 34.29,41.27 34.29,38.78 U$4.3
  Bottom 0.406: U$4.3 34.29,38.73 29.84,43.18 20.32,43.18 15.88,47.62 12.06,47.62 12.06,48.94 U$12.2
N$44
  Top 0.406: U$17.C R11.2
N$45
  Top 0.406: U$11.2 10.84,62.27 D3.A | U$3.3 38.15,46.95 38.73,46.35 38.73,44.68 T3.1
  Bottom 0.406: U$3.3 38.15,52.02 37.47,52.7 16.51,52.7 16.51,52.75 U$11.2
N$46
  Top 0.305: D8.A 14.62,11.39 U$16.2
  Top 0.406: T8.1 10.41,6.6 11.43,7.62 13.97,7.62 13.97,10.75 U$16.2
  Bottom 0.406: U$16.2 14.02,10.75 16.51,8.26 41.23,8.26 U$8.3
N$47
  Top 0.406: D2.A 10.16,71.75 10.84,71.08 U$10.2 12.7,65.45 12.7,65.41 14.86,63.25 T2.1
  Bottom 0.406: U$2.3 38.1,60.96 34.92,64.14 14.02,64.14 U$10.2
N$48
  Top 0.406: U$21.SECONDARY1 C71.1
N$49  (via drill 0.6)
  Top 0.406: v64.14,41.91 66.99,41.91 C70.2
  Bottom 0.406: U$21.SECONDARY2 52.63,41.99 64.06,41.99 v64.14,41.91
N$51
  Top 0.406: R33.1 99.06,63.18 C74.2 97.16,62.87 96.52,63.5 94.3,63.5 R32.2 89.53,63.82 R31.1
N$54
  Top 0.406: IC2.4 97.79,71.12 97.16,70.48 C64.2 96.84,67.94 95.89,67.94 95.25,67.31 92.71,67.31 91.75,66.36 R31.2 84.77,66.36 JP3.2
N$56  (via drill 0.6)
  Top 0.406: R12.2 v118.75,43.18 | v125.73,43.18 126.36,43.81 U$18.C
  Bottom 0.406: v118.75,43.18 v125.73,43.18
N$57
  Top 0.406: C66.2 104.23,44.68 U$17.E 70.89,44.68 70.48,45.09 C71.2
N$58
  Top 0.406: U$18.E 126.77,42.32 123.51,39.05 C67.1 67.94,39.05 C70.1
N$59
  Top 0.406: R30.2 123.83,41.27 123.5,40.95 C67.2 R21.1 99.38,40.64 97.16,40.64 96.11,41.68 U$17.B
N$60  (1 unrouted)
  Top 0.406: 125.73,44.77 R30.1 106.68,44.77 | 125.73,44.77 126.05,44.77 126.59,45.31 U$18.B | R20.1 125.73,44.77
N$61
  Top 0.406: R24.2 111.12,51.44 110.49,52.07 U$19.C
N$62
  Top 0.406: U$19.B 110.72,50.57 112.39,48.9 117.47,48.9 R25.1
N$63
  Top 0.406: U$20.SECONDARY_MID 111.76,56.52 113.03,55.24 113.03,54.61 | 113.03,54.61 113.03,53.98 112.62,53.57 U$19.E | 113.03,54.61 117.47,54.61 R25.2 121.6,52.38 | R29.2 121.6,52.38 | 121.6,52.38 C2.1 arc90 C2.1
N$64  (via drill 0.6)
  Top 0.406: R20.2 123.5,59.37 v123.19,59.05 | v118.11,59.05 L21.P$2
  Bottom 0.406: v123.19,59.05 v118.11,59.05
N$65  (via drill 0.6)
  Top 0.406: R21.2 101.92,42.86 v102.23,43.18 | v102.23,46.99 99.69,46.99 L17.P$2
  Bottom 0.406: v102.23,43.18 v102.23,46.99
N$66
  Top 0.406: U$20.SECONDARY1 110.67,59.52 111.12,59.05 L21.P$1
N$67
  Top 0.406: L17.P$1 99.69,52.88 U$20.SECONDARY2
N$68
  Top 0.406: C1.1 56.12,39.93 L22.P$1 56.12,44.59 U$21.SECONDARY_MID
N$69
  Top 0.406: IC1.1 137.79,66.36 | 137.79,66.36 138.11,66.36 138.43,66.04 138.43,62.23 C60.+ | IC1.3 137.48,68.26 137.79,67.94 137.79,66.36
  Top 0.61: L18.P$2 137.16,62.09 C60.+
OFFSET
  Top 0.406: C63.2 86.36,53.29 U$20.PRIMARY_BOTTOM 85.15,53.4 83.19,51.44 C68.+ 81.28,51.3 81.28,50.16 80.14,49.02 R17.2
PA_IN
  Top 0.406: R13.1 75.56,59.69 76.52,60.64 | 76.52,60.64 78.74,62.87 78.74,65.08 R14.1 | U$20.PRIMARY_TOP 78.39,58.77 76.52,60.64
PA_OUT
  Top 0.406: U$3.1 U$2.1 45.77,67.31 U$1.1 | U$4.1 41.32,38.1 U$5.1 U$6.1 U$7.1 41.27,21.55 U$8.1 41.27,15.88
  Bottom 0.406: U$4.1 41.95,41.32 46.35,45.72 46.35,48.3 U$3.1 | U$21.PRIMARY_TOP 55.28,62.87 51.44,62.87 50.16,61.59 46.35,61.59 45.77,61.01 U$2.1
PB3  (via drill 0.6)
  Top 0.305: JP1.4 124.46,7.62 123.83,8.26 116.84,8.26 116.2,7.62 116.2,6.35 114.94,5.08 93.34,5.08 v92.71,4.45 | IC8.15 94.2,17.56 93.98,17.78 v92.71,17.78
  Bottom 0.305: v92.71,4.45 v92.71,17.78
PB4  (via drill 0.6)
  Top 0.305: IC8.16 95.5,16.76 v94.61,15.88
  Bottom 0.305: JP1.1 127,2.54 126.36,1.91 119.38,1.91 117.47,3.81 98.42,3.81 96.52,1.91 93.98,1.91 93.98,15.24 v94.61,15.88
PB5  (via drill 0.6)
  Top 0.305: IC8.17 99.94,14.22 99.69,13.97 99.06,13.97 99.06,14.61 98.42,15.24 97.16,15.24 95.89,13.97 v95.89,12.06 | v95.89,3.81 117.47,3.81 119.38,1.91 124.46,1.91 JP1.3
  Bottom 0.305: v95.89,12.06 v95.89,3.81
Q
  Top 0.406: 68.58,58.42 IC4.5 68.58,60.96 69.85,62.23 IC4.11 69.85,67.94 71.75,69.85 71.75,76.2 73.03,77.47 C9.-
Q_IN
  Top 0.406: X1.R 124.66,80.7 C58.-
RESET  (via drill 0.6)
  Top 0.305: IC8.29 112.12,19.96 v112.39,19.68 | v111.76,13.97 111.76,12.38 R19.2 | JP1.5 119.38,3.81 118.11,5.08 v116.84,5.08 | v112.39,23.5 117.66,23.5 C4.1
  Bottom 0.305: v116.84,5.08 116.84,13.97 v111.76,13.97 112.39,14.61 v112.39,19.68 v112.39,23.5
RX  (via drill 0.6)
  Top 0.305: IC8.30 117.28,20.76 v117.47,20.95 | IC5.5 117.83,16.86 117.47,16.51 v116.2,16.51
  Bottom 0.305: v117.47,20.95 117.47,17.78 v116.2,16.51
SCL  (via drill 0.6)
  Top 0.254: R16.1 79.06,17.46 v76.83,15.24 | v55.88,15.88 55.88,19.68 62.23,19.68 62.37,19.55 IC7.4
  Top 0.305: v110.49,8.26 104.14,8.26 103.5,7.62 81.92,7.62 R16.1 | IC8.28 109.75,19.16 111.12,17.78 v111.12,17.14
  Bottom 0.254: v76.83,15.24 72.39,15.24 71.75,14.61 57.15,14.61 v55.88,15.88
  Bottom 0.305: v111.12,17.14 111.12,15.24 110.49,14.61 v110.49,8.26
SDA  (via drill 0.6)
  Top 0.254: IC7.5 61.87,18.14 61.59,18.41 59.69,18.41 v58.42,17.14 | v84.45,16.51 86.67,16.51 R15.1
  Top 0.305: IC8.27 107.26,18.36 107.31,18.41 108.58,18.41 v109.22,17.78 | v103.5,6.35 87.63,6.35 v87,5.71 | v87,14.61 R15.1
  Bottom 0.254: v58.42,17.14 83.82,17.14 v84.45,16.51
  Bottom 0.305: v109.22,17.78 109.22,14.61 108.58,13.97 108.58,11.43 v103.5,6.35 | v87,5.71 v87,14.61
SI4F
  Top 0.254: IC7.10 63.87,12.34 64.14,12.06 66.04,12.06 67.94,13.97 67.94,27.3 | 73.66,27.94 IC6.3
  Top 0.305: IC6.3 71.12,27.94 70.48,28.57 68.58,28.57 67.94,27.94 67.94,27.3
  Top 0.406: 73.66,27.94 74.93,27.94 76.2,26.67 IC6.11
TX  (via drill 0.6)
  Top 0.305: IC8.31 111.09,21.56 111.76,22.23 v115.57,22.23 | IC5.1 116.42,19.46 v116.2,19.68
  Bottom 0.305: v115.57,22.23 115.57,20.32 v116.2,19.68
UC_VCC  (via drill 0.6)
  Top 0.305: IC5.17 125.34,12.31 124.46,11.43 | 124.46,11.43 124.46,10.16 125.09,9.53 126.36,9.53 127,8.89 JP1.2 | 124.46,11.43 122.56,11.43 120.65,9.53 108.58,9.53 v105.41,12.7 | v97.79,13.97 97.79,12.38 C53.1 99.06,12.06 100.74,13.75 IC8.18 100.74,17.56 101.54,18.36 IC8.6 101.6,23.79 101.6,21.59 102.87,21.59 103.14,21.86 IC8.4 103.14,25.67 106.68,29.21 C52.1
  Bottom 0.305: v105.41,12.7 99.06,12.7 v97.79,13.97

### Text on the board
tPlace: GND | GND
bPlace: IQ-Modulator Bachelorarbeit / Pirmin Schöder